# Altium project ArtixDuo.PrjPcb (part 3 of 8)

## Sheet FPGA_1.SchDoc
size A1; SheetNumber: 7; SheetTotal: 14
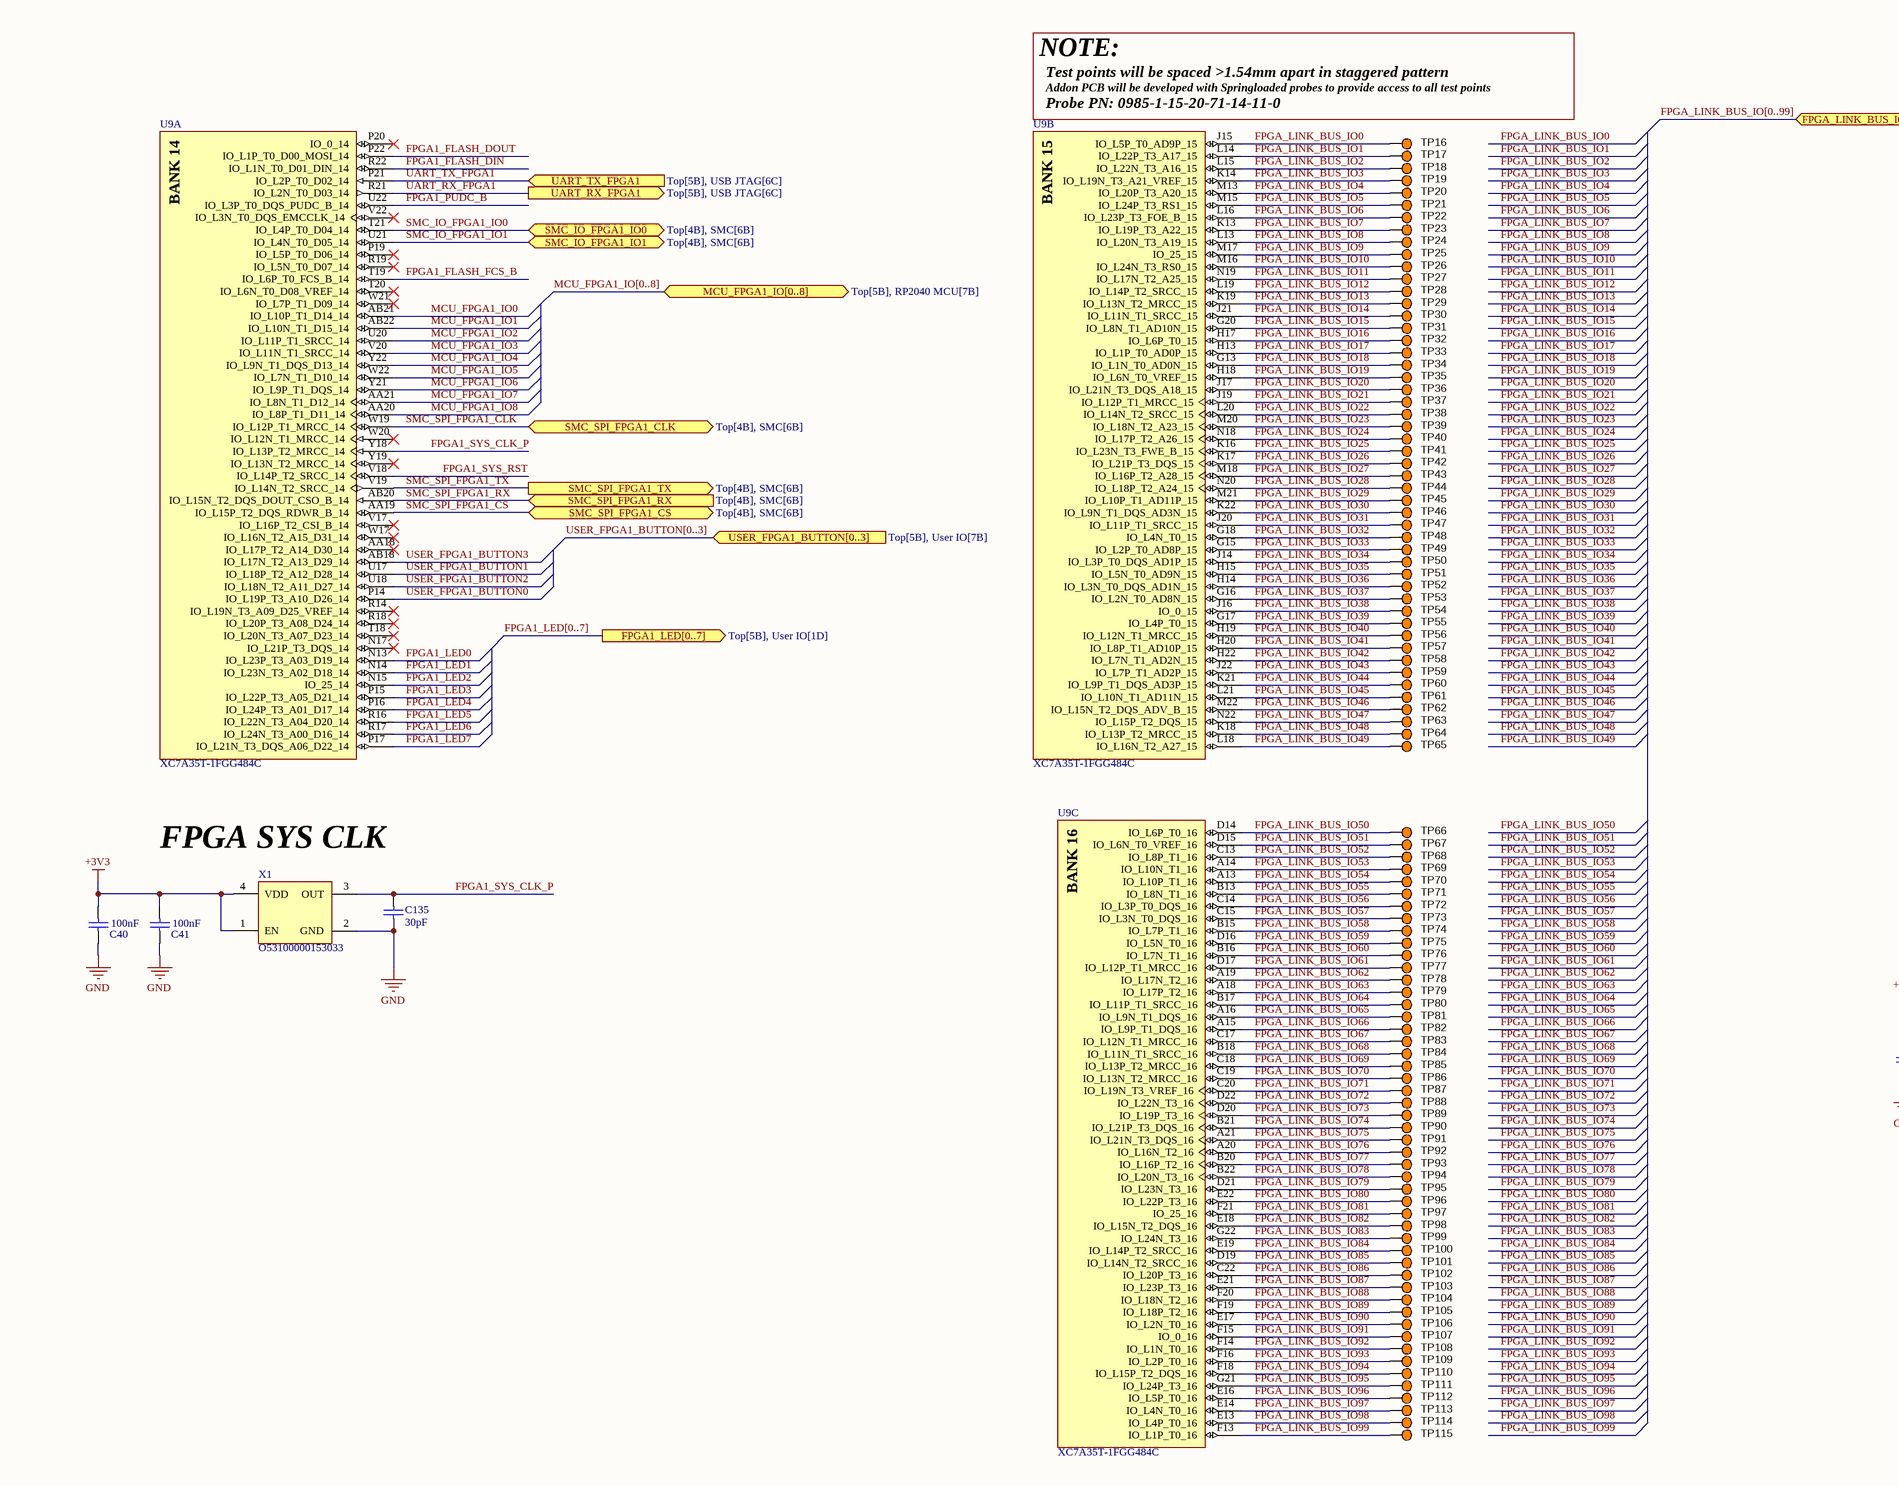
[diagram p8: FPGA_1.SchDoc, top left]
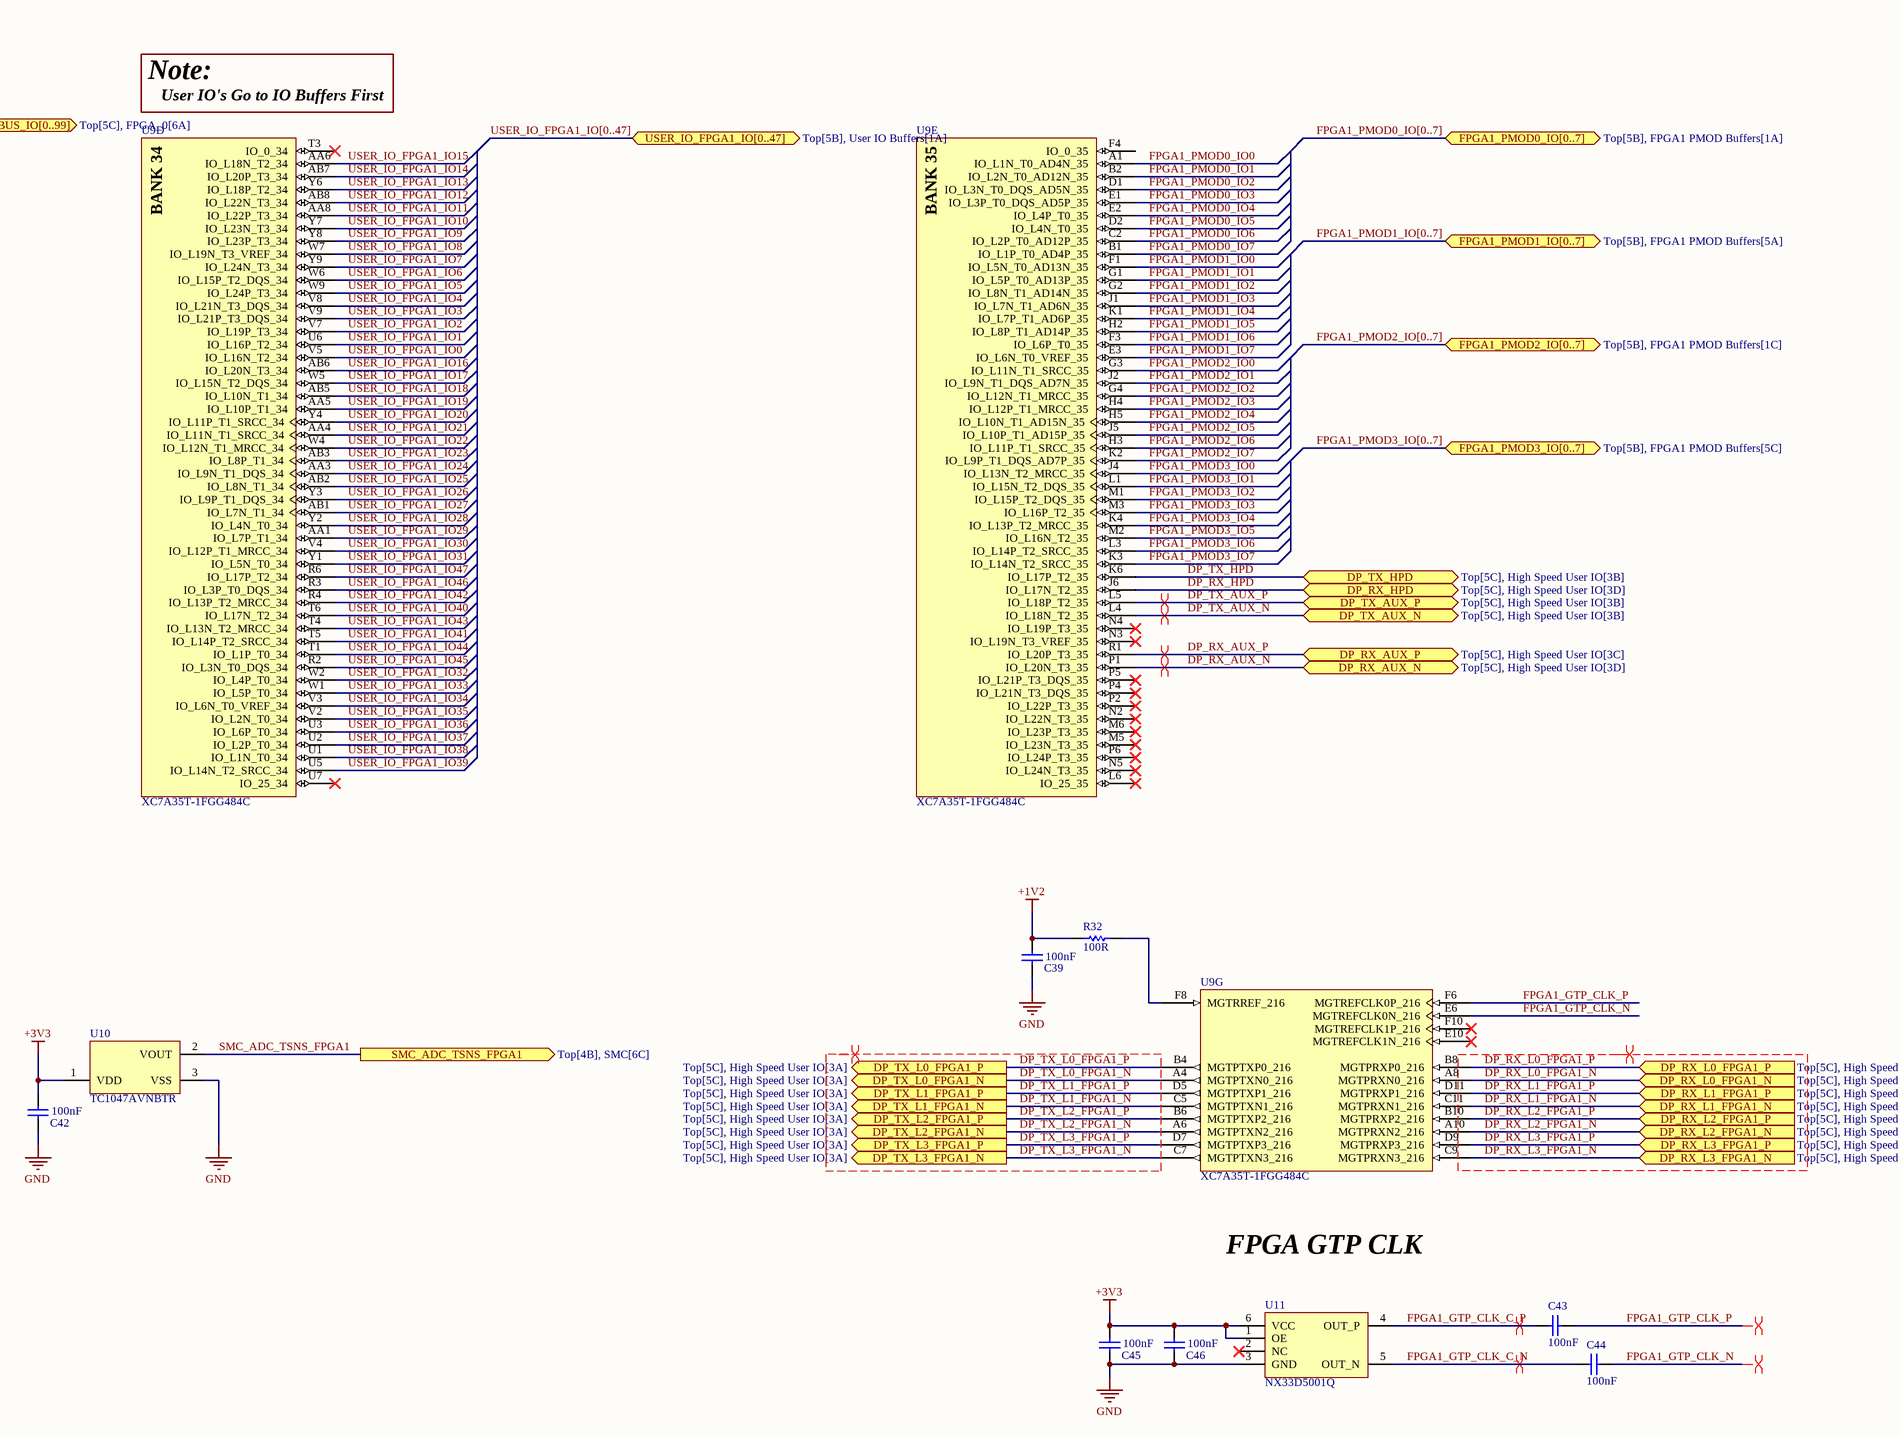
[diagram p9: FPGA_1.SchDoc, top right]
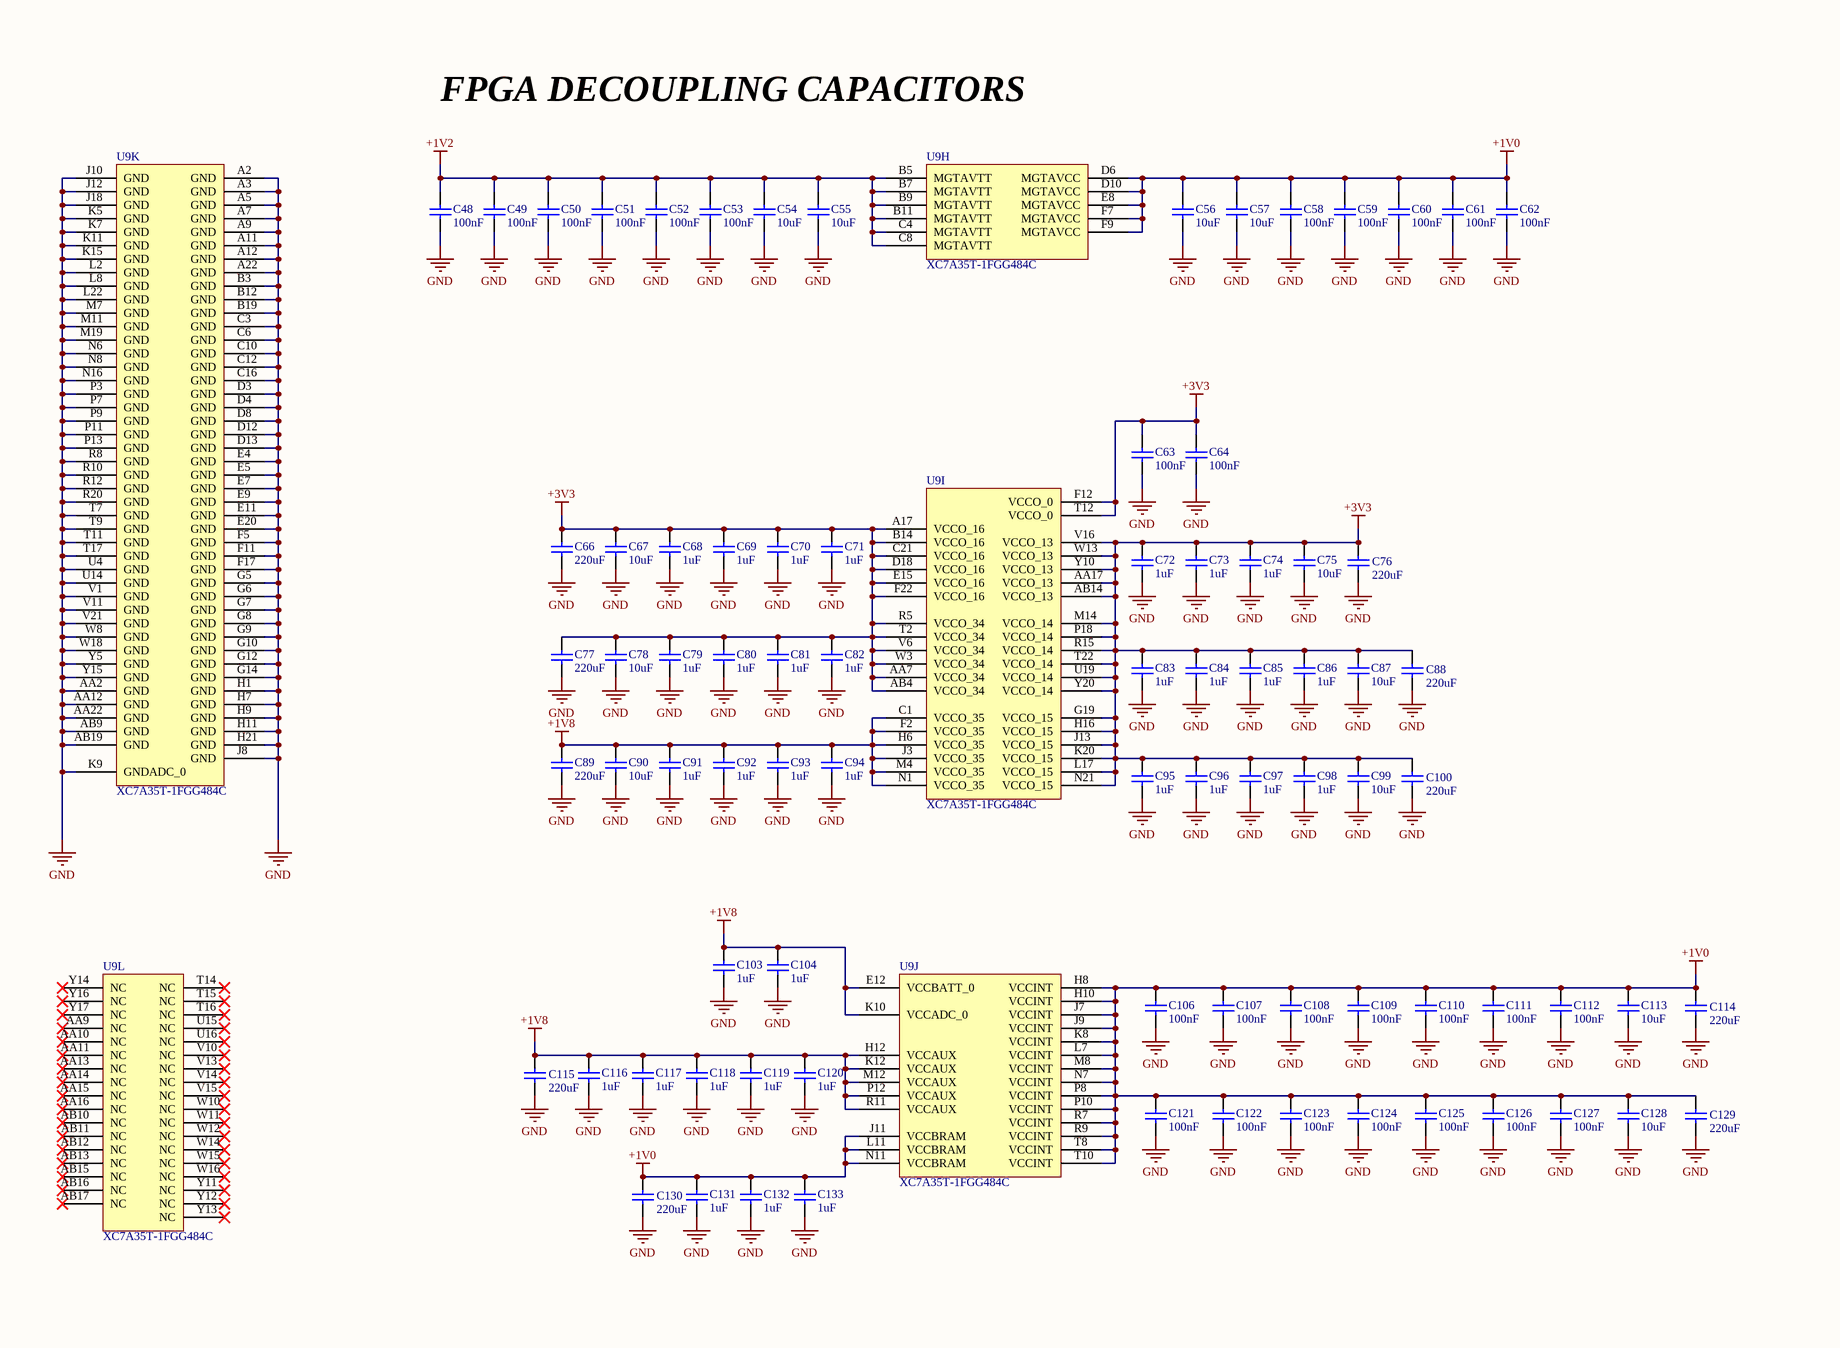
[diagram p10: FPGA_1.SchDoc, bottom left]
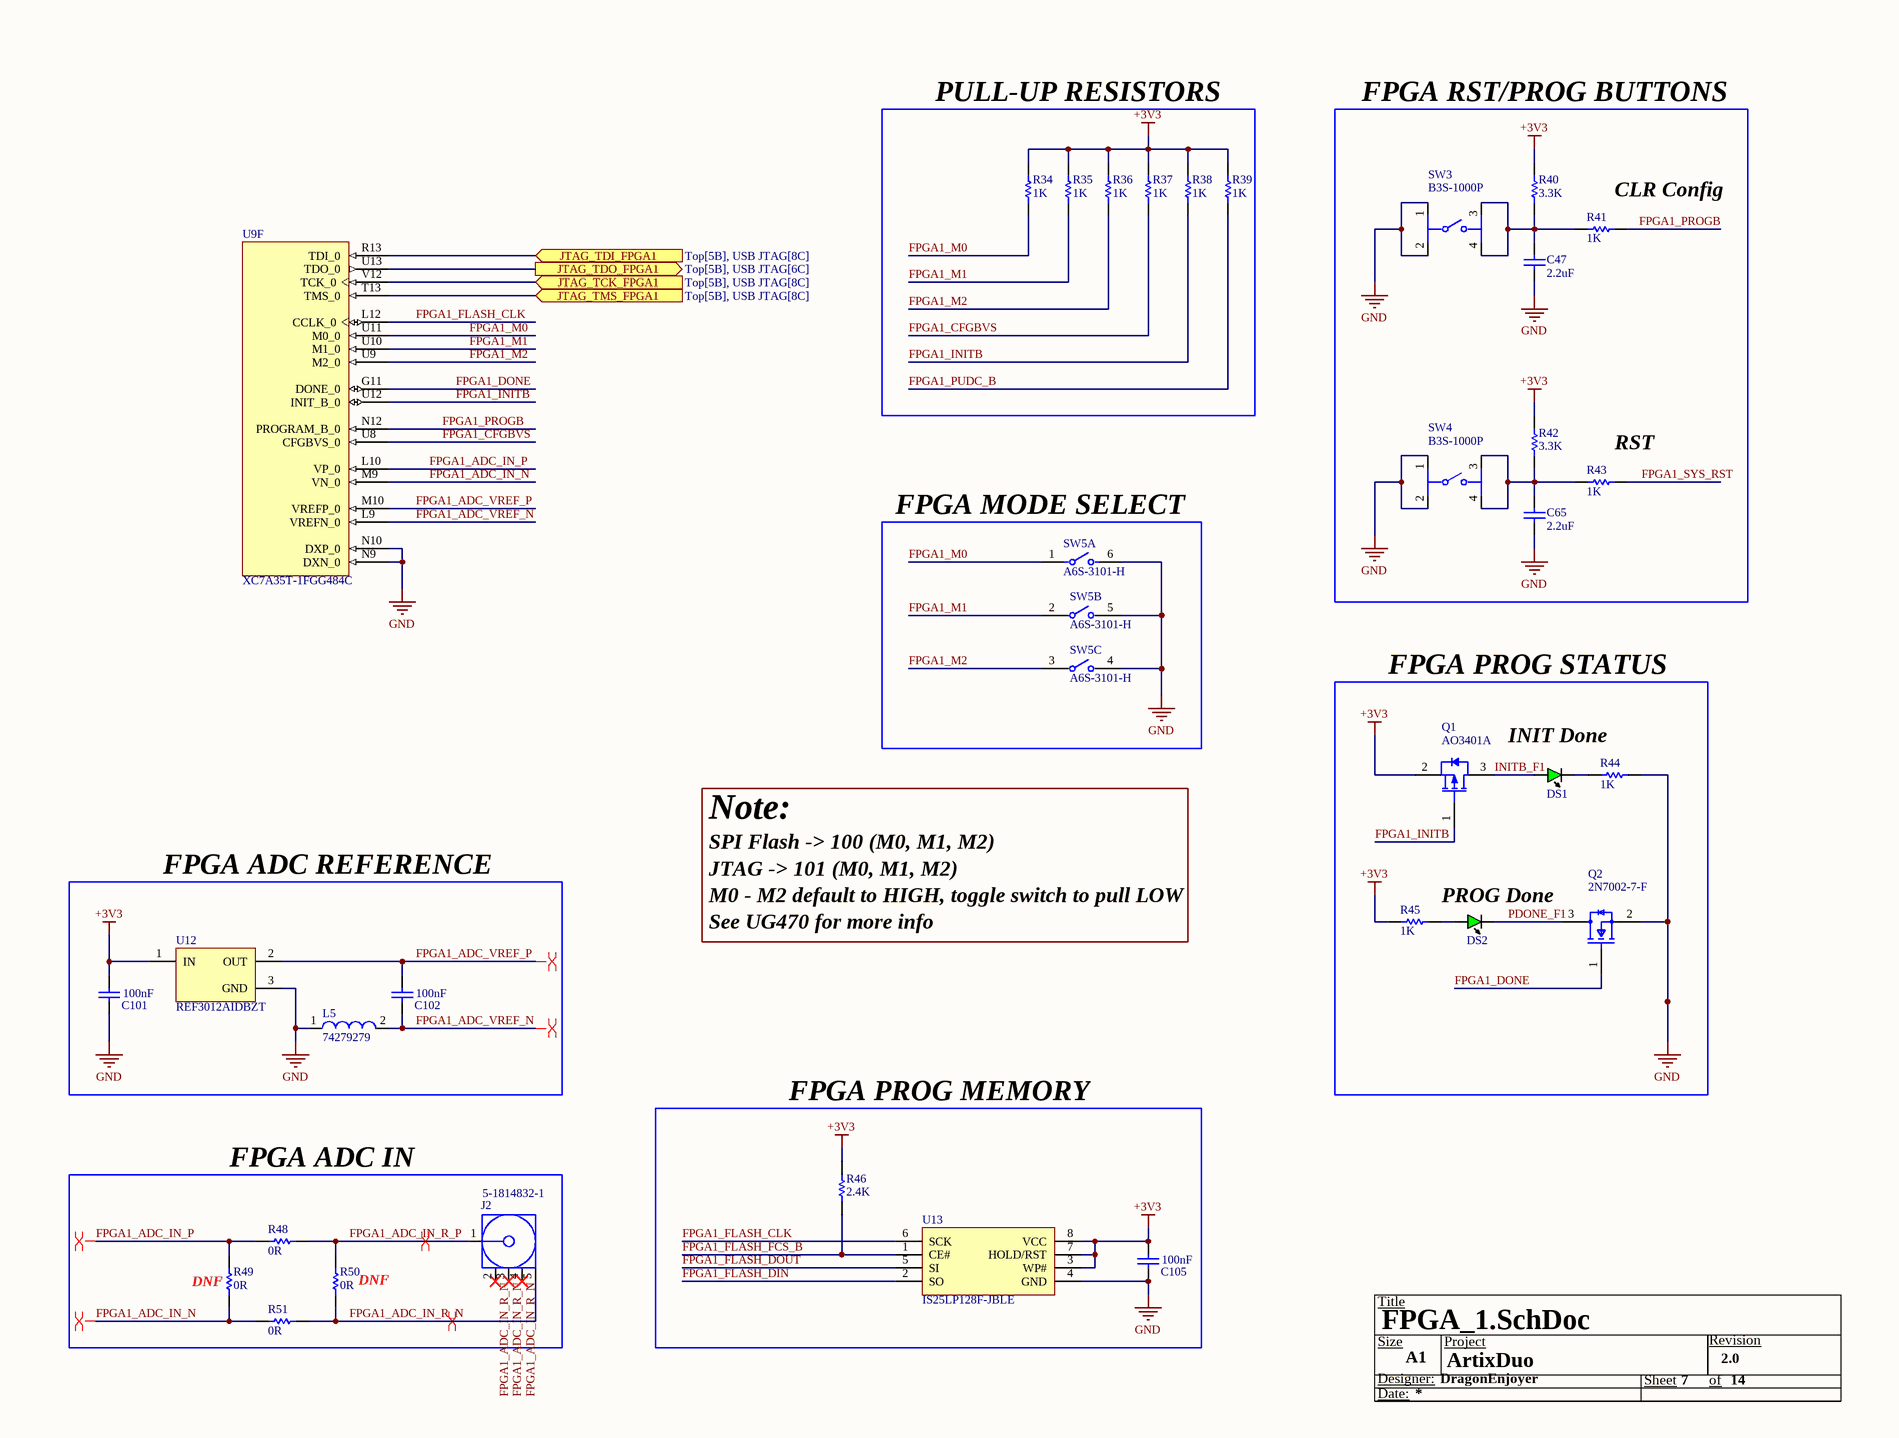
[diagram p11: FPGA_1.SchDoc, bottom right]

### Parts
(Parts that share a designator on the sheet are numbered #1, #2 ... from top to bottom, then left to right.)
*#4  Size: A1  (hidden comment: Title Block)  (graphical)
C39  100nF  [CAPC1005X05N]
C40  100nF  [CAPC1005X05N]
C41  100nF  [CAPC1005X05N]
C42  100nF  [CAPC1005X05N]
C43  100nF  [CAPC1005X05N]
C44  100nF  [CAPC1005X05N]
C45  100nF  [CAPC1005X05N]
C46  100nF  [CAPC1005X05N]
C47  2.2uF  [CAPC1005X55X25NL05T10]
C48  value 100nF  [CAPC1005X05N]  (hidden comment: GRM155R71E104KE14J)
C49  value 100nF  [CAPC1005X05N]  (hidden comment: GRM155R71E104KE14J)
C50  value 100nF  [CAPC1005X05N]  (hidden comment: GRM155R71E104KE14J)
C51  value 100nF  [CAPC1005X05N]  (hidden comment: GRM155R71E104KE14J)
C52  value 100nF  [CAPC1005X05N]  (hidden comment: GRM155R71E104KE14J)
C53  value 100nF  [CAPC1005X05N]  (hidden comment: GRM155R71E104KE14J)
C54  value 10uF  [CAPC1608X05N]  (hidden comment: GRM185R60J106ME15J)
C55  value 10uF  [CAPC1608X05N]  (hidden comment: GRM185R60J106ME15J)
C56  value 10uF  [CAPC1608X05N]  (hidden comment: GRM185R60J106ME15J)
C57  value 10uF  [CAPC1608X05N]  (hidden comment: GRM185R60J106ME15J)
C58  value 100nF  [CAPC1005X05N]  (hidden comment: GRM155R71E104KE14J)
C59  value 100nF  [CAPC1005X05N]  (hidden comment: GRM155R71E104KE14J)
C60  value 100nF  [CAPC1005X05N]  (hidden comment: GRM155R71E104KE14J)
C61  value 100nF  [CAPC1005X05N]  (hidden comment: GRM155R71E104KE14J)
C62  value 100nF  [CAPC1005X05N]  (hidden comment: GRM155R71E104KE14J)
C63  value 100nF  [CAPC1005X05N]  (hidden comment: GRM155R71E104KE14J)
C64  value 100nF  [CAPC1005X05N]  (hidden comment: GRM155R71E104KE14J)
C65  2.2uF  [CAPC1005X55X25NL05T10]
C66  220uF  [CAPC3225X25N]
C67  value 10uF  [CAPC1608X05N]  (hidden comment: GRM185R60J106ME15J)
C68  value 1uF  [CAPC1005X05N]  (hidden comment: GRM153R61A105ME95D)
C69  value 1uF  [CAPC1005X05N]  (hidden comment: GRM153R61A105ME95D)
C70  value 1uF  [CAPC1005X05N]  (hidden comment: GRM153R61A105ME95D)
C71  value 1uF  [CAPC1005X05N]  (hidden comment: GRM153R61A105ME95D)
C72  value 1uF  [CAPC1005X05N]  (hidden comment: GRM153R61A105ME95D)
C73  value 1uF  [CAPC1005X05N]  (hidden comment: GRM153R61A105ME95D)
C74  value 1uF  [CAPC1005X05N]  (hidden comment: GRM153R61A105ME95D)
C75  value 10uF  [CAPC1608X05N]  (hidden comment: GRM185R60J106ME15J)
C76  220uF  [CAPC3225X25N]
C77  220uF  [CAPC3225X25N]
C78  value 10uF  [CAPC1608X05N]  (hidden comment: GRM185R60J106ME15J)
C79  value 1uF  [CAPC1005X05N]  (hidden comment: GRM153R61A105ME95D)
C80  value 1uF  [CAPC1005X05N]  (hidden comment: GRM153R61A105ME95D)
C81  value 1uF  [CAPC1005X05N]  (hidden comment: GRM153R61A105ME95D)
C82  value 1uF  [CAPC1005X05N]  (hidden comment: GRM153R61A105ME95D)
C83  value 1uF  [CAPC1005X05N]  (hidden comment: GRM153R61A105ME95D)
C84  value 1uF  [CAPC1005X05N]  (hidden comment: GRM153R61A105ME95D)
C85  value 1uF  [CAPC1005X05N]  (hidden comment: GRM153R61A105ME95D)
C86  value 1uF  [CAPC1005X05N]  (hidden comment: GRM153R61A105ME95D)
C87  value 10uF  [CAPC1608X05N]  (hidden comment: GRM185R60J106ME15J)
C88  220uF  [CAPC3225X25N]
C89  220uF  [CAPC3225X25N]
C90  value 10uF  [CAPC1608X05N]  (hidden comment: GRM185R60J106ME15J)
C91  value 1uF  [CAPC1005X05N]  (hidden comment: GRM153R61A105ME95D)
C92  value 1uF  [CAPC1005X05N]  (hidden comment: GRM153R61A105ME95D)
C93  value 1uF  [CAPC1005X05N]  (hidden comment: GRM153R61A105ME95D)
C94  value 1uF  [CAPC1005X05N]  (hidden comment: GRM153R61A105ME95D)
C95  value 1uF  [CAPC1005X05N]  (hidden comment: GRM153R61A105ME95D)
C96  value 1uF  [CAPC1005X05N]  (hidden comment: GRM153R61A105ME95D)
C97  value 1uF  [CAPC1005X05N]  (hidden comment: GRM153R61A105ME95D)
C98  value 1uF  [CAPC1005X05N]  (hidden comment: GRM153R61A105ME95D)
C99  value 10uF  [CAPC1608X05N]  (hidden comment: GRM185R60J106ME15J)
C100  220uF  [CAPC3225X25N]
C101  100nF  [CAPC1005X05N]
C102  100nF  [CAPC1005X05N]
C103  value 1uF  [CAPC1005X05N]  (hidden comment: GRM153R61A105ME95D)
C104  value 1uF  [CAPC1005X05N]  (hidden comment: GRM153R61A105ME95D)
C105  100nF  [CAPC1005X05N]
C106  value 100nF  [CAPC1005X05N]  (hidden comment: GRM155R71E104KE14J)
C107  value 100nF  [CAPC1005X05N]  (hidden comment: GRM155R71E104KE14J)
C108  value 100nF  [CAPC1005X05N]  (hidden comment: GRM155R71E104KE14J)
C109  value 100nF  [CAPC1005X05N]  (hidden comment: GRM155R71E104KE14J)
C110  value 100nF  [CAPC1005X05N]  (hidden comment: GRM155R71E104KE14J)
C111  value 100nF  [CAPC1005X05N]  (hidden comment: GRM155R71E104KE14J)
C112  value 100nF  [CAPC1005X05N]  (hidden comment: GRM155R71E104KE14J)
C113  value 10uF  [CAPC1608X05N]  (hidden comment: GRM185R60J106ME15J)
C114  220uF  [CAPC3225X25N]
C115  220uF  [CAPC3225X25N]
C116  value 1uF  [CAPC1005X05N]  (hidden comment: GRM153R61A105ME95D)
C117  value 1uF  [CAPC1005X05N]  (hidden comment: GRM153R61A105ME95D)
C118  value 1uF  [CAPC1005X05N]  (hidden comment: GRM153R61A105ME95D)
C119  value 1uF  [CAPC1005X05N]  (hidden comment: GRM153R61A105ME95D)
C120  value 1uF  [CAPC1005X05N]  (hidden comment: GRM153R61A105ME95D)
C121  value 100nF  [CAPC1005X05N]  (hidden comment: GRM155R71E104KE14J)
C122  value 100nF  [CAPC1005X05N]  (hidden comment: GRM155R71E104KE14J)
C123  value 100nF  [CAPC1005X05N]  (hidden comment: GRM155R71E104KE14J)
C124  value 100nF  [CAPC1005X05N]  (hidden comment: GRM155R71E104KE14J)
C125  value 100nF  [CAPC1005X05N]  (hidden comment: GRM155R71E104KE14J)
C126  value 100nF  [CAPC1005X05N]  (hidden comment: GRM155R71E104KE14J)
C127  value 100nF  [CAPC1005X05N]  (hidden comment: GRM155R71E104KE14J)
C128  value 10uF  [CAPC1608X05N]  (hidden comment: GRM185R60J106ME15J)
C129  220uF  [CAPC3225X25N]
C130  220uF  [CAPC3225X25N]
C131  value 1uF  [CAPC1005X05N]  (hidden comment: GRM153R61A105ME95D)
C132  value 1uF  [CAPC1005X05N]  (hidden comment: GRM153R61A105ME95D)
C133  value 1uF  [CAPC1005X05N]  (hidden comment: GRM153R61A105ME95D)
C135  30pF  [CAPC1005X56X25NL10T15]
DS1  SMLLX0603GWTR  [LUMX-SML-LX0603_V]  (value not drawn)
DS2  SMLLX0603GWTR  [LUMX-SML-LX0603_V]  (value not drawn)
J2  5-1814832-1  [TECO-5-1814832-1_V]
L5  74279279  [SMD-0402]
Q1  AO3401A  [AO-SOT-23-3L_V]
Q2  2N7002-7-F  [FP-SOT23-MFG]
R32  100R  [RESC1005X40X25NL05T05]
R34  1K  [RESC1005X40X25NL05T10]
R35  1K  [RESC1005X40X25NL05T10]
R36  1K  [RESC1005X40X25NL05T10]
R37  1K  [RESC1005X40X25NL05T10]
R38  1K  [RESC1005X40X25NL05T10]
R39  1K  [RESC1005X40X25NL05T10]
R40  3.3K  [RESC1005X40X25NL05T10]
R41  1K  [RESC1005X40X25NL05T10]
R42  3.3K  [RESC1005X40X25NL05T10]
R43  1K  [RESC1005X40X25NL05T10]
R44  1K  [RESC1005X40X25NL05T10]
R45  1K  [RESC1005X40X25NL05T10]
R46  2.4K  [RESC1005X40X25NL05T05]
R48  0R  [RESC1005X40X25NL05T10]
R49  0R  [RESC1005X40X25NL05T10]
R50  0R  [RESC1005X40X25NL05T10]
R51  0R  [RESC1005X40X25NL05T10]
SW3  B3S-1000P  [FP-B3S-1000P-MFG]
SW4  B3S-1000P  [FP-B3S-1000P-MFG]
SW5  A6S-3101-H  [FP-A6S-3101-H-MFG]  (parts A,B,C of 3)
TP16  Test Point Round 0.5mm  [Test Point Round 0.5mm-Footprint-1]  (value not drawn)
TP17  Test Point Round 0.5mm  [Test Point Round 0.5mm-Footprint-1]  (value not drawn)
TP18  Test Point Round 0.5mm  [Test Point Round 0.5mm-Footprint-1]  (value not drawn)
TP19  Test Point Round 0.5mm  [Test Point Round 0.5mm-Footprint-1]  (value not drawn)
TP20  Test Point Round 0.5mm  [Test Point Round 0.5mm-Footprint-1]  (value not drawn)
TP21  Test Point Round 0.5mm  [Test Point Round 0.5mm-Footprint-1]  (value not drawn)
TP22  Test Point Round 0.5mm  [Test Point Round 0.5mm-Footprint-1]  (value not drawn)
TP23  Test Point Round 0.5mm  [Test Point Round 0.5mm-Footprint-1]  (value not drawn)
TP24  Test Point Round 0.5mm  [Test Point Round 0.5mm-Footprint-1]  (value not drawn)
TP25  Test Point Round 0.5mm  [Test Point Round 0.5mm-Footprint-1]  (value not drawn)
TP26  Test Point Round 0.5mm  [Test Point Round 0.5mm-Footprint-1]  (value not drawn)
TP27  Test Point Round 0.5mm  [Test Point Round 0.5mm-Footprint-1]  (value not drawn)
TP28  Test Point Round 0.5mm  [Test Point Round 0.5mm-Footprint-1]  (value not drawn)
TP29  Test Point Round 0.5mm  [Test Point Round 0.5mm-Footprint-1]  (value not drawn)
TP30  Test Point Round 0.5mm  [Test Point Round 0.5mm-Footprint-1]  (value not drawn)
TP31  Test Point Round 0.5mm  [Test Point Round 0.5mm-Footprint-1]  (value not drawn)
TP32  Test Point Round 0.5mm  [Test Point Round 0.5mm-Footprint-1]  (value not drawn)
TP33  Test Point Round 0.5mm  [Test Point Round 0.5mm-Footprint-1]  (value not drawn)
TP34  Test Point Round 0.5mm  [Test Point Round 0.5mm-Footprint-1]  (value not drawn)
TP35  Test Point Round 0.5mm  [Test Point Round 0.5mm-Footprint-1]  (value not drawn)
TP36  Test Point Round 0.5mm  [Test Point Round 0.5mm-Footprint-1]  (value not drawn)
TP37  Test Point Round 0.5mm  [Test Point Round 0.5mm-Footprint-1]  (value not drawn)
TP38  Test Point Round 0.5mm  [Test Point Round 0.5mm-Footprint-1]  (value not drawn)
TP39  Test Point Round 0.5mm  [Test Point Round 0.5mm-Footprint-1]  (value not drawn)
TP40  Test Point Round 0.5mm  [Test Point Round 0.5mm-Footprint-1]  (value not drawn)
TP41  Test Point Round 0.5mm  [Test Point Round 0.5mm-Footprint-1]  (value not drawn)
TP42  Test Point Round 0.5mm  [Test Point Round 0.5mm-Footprint-1]  (value not drawn)
TP43  Test Point Round 0.5mm  [Test Point Round 0.5mm-Footprint-1]  (value not drawn)
TP44  Test Point Round 0.5mm  [Test Point Round 0.5mm-Footprint-1]  (value not drawn)
TP45  Test Point Round 0.5mm  [Test Point Round 0.5mm-Footprint-1]  (value not drawn)
TP46  Test Point Round 0.5mm  [Test Point Round 0.5mm-Footprint-1]  (value not drawn)
TP47  Test Point Round 0.5mm  [Test Point Round 0.5mm-Footprint-1]  (value not drawn)
TP48  Test Point Round 0.5mm  [Test Point Round 0.5mm-Footprint-1]  (value not drawn)
TP49  Test Point Round 0.5mm  [Test Point Round 0.5mm-Footprint-1]  (value not drawn)
TP50  Test Point Round 0.5mm  [Test Point Round 0.5mm-Footprint-1]  (value not drawn)
TP51  Test Point Round 0.5mm  [Test Point Round 0.5mm-Footprint-1]  (value not drawn)
TP52  Test Point Round 0.5mm  [Test Point Round 0.5mm-Footprint-1]  (value not drawn)
TP53  Test Point Round 0.5mm  [Test Point Round 0.5mm-Footprint-1]  (value not drawn)
TP54  Test Point Round 0.5mm  [Test Point Round 0.5mm-Footprint-1]  (value not drawn)
TP55  Test Point Round 0.5mm  [Test Point Round 0.5mm-Footprint-1]  (value not drawn)
TP56  Test Point Round 0.5mm  [Test Point Round 0.5mm-Footprint-1]  (value not drawn)
TP57  Test Point Round 0.5mm  [Test Point Round 0.5mm-Footprint-1]  (value not drawn)
TP58  Test Point Round 0.5mm  [Test Point Round 0.5mm-Footprint-1]  (value not drawn)
TP59  Test Point Round 0.5mm  [Test Point Round 0.5mm-Footprint-1]  (value not drawn)
TP60  Test Point Round 0.5mm  [Test Point Round 0.5mm-Footprint-1]  (value not drawn)
TP61  Test Point Round 0.5mm  [Test Point Round 0.5mm-Footprint-1]  (value not drawn)
TP62  Test Point Round 0.5mm  [Test Point Round 0.5mm-Footprint-1]  (value not drawn)
TP63  Test Point Round 0.5mm  [Test Point Round 0.5mm-Footprint-1]  (value not drawn)
TP64  Test Point Round 0.5mm  [Test Point Round 0.5mm-Footprint-1]  (value not drawn)
TP65  Test Point Round 0.5mm  [Test Point Round 0.5mm-Footprint-1]  (value not drawn)
TP66  Test Point Round 0.5mm  [Test Point Round 0.5mm-Footprint-1]  (value not drawn)
TP67  Test Point Round 0.5mm  [Test Point Round 0.5mm-Footprint-1]  (value not drawn)
TP68  Test Point Round 0.5mm  [Test Point Round 0.5mm-Footprint-1]  (value not drawn)
TP69  Test Point Round 0.5mm  [Test Point Round 0.5mm-Footprint-1]  (value not drawn)
TP70  Test Point Round 0.5mm  [Test Point Round 0.5mm-Footprint-1]  (value not drawn)
TP71  Test Point Round 0.5mm  [Test Point Round 0.5mm-Footprint-1]  (value not drawn)
TP72  Test Point Round 0.5mm  [Test Point Round 0.5mm-Footprint-1]  (value not drawn)
TP73  Test Point Round 0.5mm  [Test Point Round 0.5mm-Footprint-1]  (value not drawn)
TP74  Test Point Round 0.5mm  [Test Point Round 0.5mm-Footprint-1]  (value not drawn)
TP75  Test Point Round 0.5mm  [Test Point Round 0.5mm-Footprint-1]  (value not drawn)
TP76  Test Point Round 0.5mm  [Test Point Round 0.5mm-Footprint-1]  (value not drawn)
TP77  Test Point Round 0.5mm  [Test Point Round 0.5mm-Footprint-1]  (value not drawn)
TP78  Test Point Round 0.5mm  [Test Point Round 0.5mm-Footprint-1]  (value not drawn)
TP79  Test Point Round 0.5mm  [Test Point Round 0.5mm-Footprint-1]  (value not drawn)
TP80  Test Point Round 0.5mm  [Test Point Round 0.5mm-Footprint-1]  (value not drawn)
TP81  Test Point Round 0.5mm  [Test Point Round 0.5mm-Footprint-1]  (value not drawn)
TP82  Test Point Round 0.5mm  [Test Point Round 0.5mm-Footprint-1]  (value not drawn)
TP83  Test Point Round 0.5mm  [Test Point Round 0.5mm-Footprint-1]  (value not drawn)
TP84  Test Point Round 0.5mm  [Test Point Round 0.5mm-Footprint-1]  (value not drawn)
TP85  Test Point Round 0.5mm  [Test Point Round 0.5mm-Footprint-1]  (value not drawn)
TP86  Test Point Round 0.5mm  [Test Point Round 0.5mm-Footprint-1]  (value not drawn)
TP87  Test Point Round 0.5mm  [Test Point Round 0.5mm-Footprint-1]  (value not drawn)
TP88  Test Point Round 0.5mm  [Test Point Round 0.5mm-Footprint-1]  (value not drawn)
TP89  Test Point Round 0.5mm  [Test Point Round 0.5mm-Footprint-1]  (value not drawn)
TP90  Test Point Round 0.5mm  [Test Point Round 0.5mm-Footprint-1]  (value not drawn)
TP91  Test Point Round 0.5mm  [Test Point Round 0.5mm-Footprint-1]  (value not drawn)
TP92  Test Point Round 0.5mm  [Test Point Round 0.5mm-Footprint-1]  (value not drawn)
TP93  Test Point Round 0.5mm  [Test Point Round 0.5mm-Footprint-1]  (value not drawn)
TP94  Test Point Round 0.5mm  [Test Point Round 0.5mm-Footprint-1]  (value not drawn)
TP95  Test Point Round 0.5mm  [Test Point Round 0.5mm-Footprint-1]  (value not drawn)
TP96  Test Point Round 0.5mm  [Test Point Round 0.5mm-Footprint-1]  (value not drawn)
TP97  Test Point Round 0.5mm  [Test Point Round 0.5mm-Footprint-1]  (value not drawn)
TP98  Test Point Round 0.5mm  [Test Point Round 0.5mm-Footprint-1]  (value not drawn)
TP99  Test Point Round 0.5mm  [Test Point Round 0.5mm-Footprint-1]  (value not drawn)
TP100  Test Point Round 0.5mm  [Test Point Round 0.5mm-Footprint-1]  (value not drawn)
TP101  Test Point Round 0.5mm  [Test Point Round 0.5mm-Footprint-1]  (value not drawn)
TP102  Test Point Round 0.5mm  [Test Point Round 0.5mm-Footprint-1]  (value not drawn)
TP103  Test Point Round 0.5mm  [Test Point Round 0.5mm-Footprint-1]  (value not drawn)
TP104  Test Point Round 0.5mm  [Test Point Round 0.5mm-Footprint-1]  (value not drawn)
TP105  Test Point Round 0.5mm  [Test Point Round 0.5mm-Footprint-1]  (value not drawn)
TP106  Test Point Round 0.5mm  [Test Point Round 0.5mm-Footprint-1]  (value not drawn)
TP107  Test Point Round 0.5mm  [Test Point Round 0.5mm-Footprint-1]  (value not drawn)
TP108  Test Point Round 0.5mm  [Test Point Round 0.5mm-Footprint-1]  (value not drawn)
TP109  Test Point Round 0.5mm  [Test Point Round 0.5mm-Footprint-1]  (value not drawn)
TP110  Test Point Round 0.5mm  [Test Point Round 0.5mm-Footprint-1]  (value not drawn)
TP111  Test Point Round 0.5mm  [Test Point Round 0.5mm-Footprint-1]  (value not drawn)
TP112  Test Point Round 0.5mm  [Test Point Round 0.5mm-Footprint-1]  (value not drawn)
TP113  Test Point Round 0.5mm  [Test Point Round 0.5mm-Footprint-1]  (value not drawn)
TP114  Test Point Round 0.5mm  [Test Point Round 0.5mm-Footprint-1]  (value not drawn)
TP115  Test Point Round 0.5mm  [Test Point Round 0.5mm-Footprint-1]  (value not drawn)
U9  XC7A35T-1FGG484C  [FGG484]  (parts A,B,C,D,E,F,G,H,I,J,K,L of 12)
U10  TC1047AVNBTR  [SOT-23-NB3_L]
U11  NX33D5001Q  [SOTFL125P185X90-6N]
U12  REF3012AIDBZT  [DBZ0003A_L]
U13  IS25LP128F-JBLE  [SOIC127P790X216-8N]
X1  O53100000153033  [DFN254P500X120-4N]

### Blocks framed on the sheet
PULL-UP RESISTORS: R34-R39
FPGA RST/PROG BUTTONS: C47 C65 R40-R43 SW3 SW4
FPGA MODE SELECT: SW5
FPGA PROG STATUS: DS1 DS2 Q1 Q2 R44 R45
FPGA ADC REFERENCE: C101 C102 L5 U12
FPGA PROG MEMORY: C105 R46 U13

### Ports
DP_RX_AUX_N (bidir, see Top[5C], High Speed User IO[3D]), DP_RX_AUX_P (bidir, see Top[5C], High Speed User IO[3C]), DP_RX_HPD (bidir, see Top[5C], High Speed User IO[3D]), DP_RX_L0_FPGA1_N (in, see Top[5C], High Speed User IO[3C]), DP_RX_L0_FPGA1_P (in, see Top[5C], High Speed User IO[3C]), DP_RX_L1_FPGA1_N (in, see Top[5C], High Speed User IO[3C]), DP_RX_L1_FPGA1_P (in, see Top[5C], High Speed User IO[3C]), DP_RX_L2_FPGA1_N (in, see Top[5C], High Speed User IO[3C]), DP_RX_L2_FPGA1_P (in, see Top[5C], High Speed User IO[3C]), DP_RX_L3_FPGA1_N (in, see Top[5C], High Speed User IO[3C]), DP_RX_L3_FPGA1_P (in, see Top[5C], High Speed User IO[3C]), DP_TX_AUX_N (bidir, see Top[5C], High Speed User IO[3B]), DP_TX_AUX_P (bidir, see Top[5C], High Speed User IO[3B]), DP_TX_HPD (bidir, see Top[5C], High Speed User IO[3B]), DP_TX_L0_FPGA1_N (out, see Top[5C], High Speed User IO[3A]), DP_TX_L0_FPGA1_P (out, see Top[5C], High Speed User IO[3A]), DP_TX_L1_FPGA1_N (out, see Top[5C], High Speed User IO[3A]), DP_TX_L1_FPGA1_P (out, see Top[5C], High Speed User IO[3A]), DP_TX_L2_FPGA1_N (out, see Top[5C], High Speed User IO[3A]), DP_TX_L2_FPGA1_P (out, see Top[5C], High Speed User IO[3A]), DP_TX_L3_FPGA1_N (out, see Top[5C], High Speed User IO[3A]), DP_TX_L3_FPGA1_P (out, see Top[5C], High Speed User IO[3A]), FPGA1_LED[0..7] (out, see Top[5B], User IO[1D]), FPGA1_PMOD0_IO[0..7] (bidir, see Top[5B], FPGA1 PMOD Buffers[1A]), FPGA1_PMOD1_IO[0..7] (bidir, see Top[5B], FPGA1 PMOD Buffers[5A]), FPGA1_PMOD2_IO[0..7] (bidir, see Top[5B], FPGA1 PMOD Buffers[1C]), FPGA1_PMOD3_IO[0..7] (bidir, see Top[5B], FPGA1 PMOD Buffers[5C]), FPGA_LINK_BUS_IO[0..99] (bidir, see Top[5C], FPGA_0[6A]), JTAG_TCK_FPGA1 (in, see Top[5B], USB JTAG[8C]), JTAG_TDI_FPGA1 (in, see Top[5B], USB JTAG[8C]), JTAG_TDO_FPGA1 (out, see Top[5B], USB JTAG[6C]), JTAG_TMS_FPGA1 (in, see Top[5B], USB JTAG[8C]), MCU_FPGA1_IO[0..8] (bidir, see Top[5B], RP2040 MCU[7B]), SMC_ADC_TSNS_FPGA1 (out, see Top[4B], SMC[6C]), SMC_IO_FPGA1_IO0 (bidir, see Top[4B], SMC[6B]), SMC_IO_FPGA1_IO1 (bidir, see Top[4B], SMC[6B]), SMC_SPI_FPGA1_CLK (bidir, see Top[4B], SMC[6B]), SMC_SPI_FPGA1_CS (bidir, see Top[4B], SMC[6B]), SMC_SPI_FPGA1_RX (in, see Top[4B], SMC[6B]), SMC_SPI_FPGA1_TX (out, see Top[4B], SMC[6B]), UART_RX_FPGA1 (out, see Top[5B], USB JTAG[6C]), UART_TX_FPGA1 (in, see Top[5B], USB JTAG[6C]), USER_FPGA1_BUTTON[0..3] (in, see Top[5B], User IO[7B]), USER_IO_FPGA1_IO[0..47] (bidir, see Top[5B], User IO Buffers[1A])

### Nets
+1V0: C56.2 C57.2 C58.2 C59.2 C60.2 C61.2 C62.2 C106.2 C107.2 C108.2 C109.2 C110.2 C111.2 C112.2 C113.2 C114.2 C121.2 C122.2 C123.2 C124.2 C125.2 C126.2 C127.2 C128.2 C129.2 C130.2 C131.2 C132.2 C133.2 U9.D6(MGTAVCC) U9.D10(MGTAVCC) U9.E8(MGTAVCC) U9.F7(MGTAVCC) U9.F9(MGTAVCC) U9.H8(VCCINT) U9.H10(VCCINT) U9.J7(VCCINT) U9.J9(VCCINT) U9.J11(VCCBRAM) U9.K8(VCCINT) U9.L7(VCCINT) U9.L11(VCCBRAM) U9.M8(VCCINT) U9.N7(VCCINT) U9.N11(VCCBRAM) U9.P8(VCCINT) U9.P10(VCCINT) U9.R7(VCCINT) U9.R9(VCCINT) U9.T8(VCCINT) U9.T10(VCCINT)
+1V2: C39.2 C48.2 C49.2 C50.2 C51.2 C52.2 C53.2 C54.2 C55.2 R32.1 U9.B5(MGTAVTT) U9.B7(MGTAVTT) U9.B9(MGTAVTT) U9.B11(MGTAVTT) U9.C4(MGTAVTT) U9.C8(MGTAVTT)
+1V8: C89.2 C90.2 C91.2 C92.2 C93.2 C94.2 C103.2 C104.2 C115.2 C116.2 C117.2 C118.2 C119.2 C120.2 U9.C1(VCCO_35) U9.E12(VCCBATT_0) U9.F2(VCCO_35) U9.H6(VCCO_35) U9.H12(VCCAUX) U9.J3(VCCO_35) U9.K10(VCCADC_0) U9.K12(VCCAUX) U9.M4(VCCO_35) U9.M12(VCCAUX) U9.N1(VCCO_35) U9.P12(VCCAUX) U9.R11(VCCAUX)
+3V3: C40.2 C41.2 C42.2 C45.2 C46.2 C63.2 C64.2 C66.2 C67.2 C68.2 C69.2 C70.2 C71.2 C72.2 C73.2 C74.2 C75.2 C76.2 C77.2 C78.2 C79.2 C80.2 C81.2 C82.2 C83.2 C84.2 C85.2 C86.2 C87.2 C88.2 C95.2 C96.2 C97.2 C98.2 C99.2 C100.2 C101.2 C105.2 Q1.2(SOURCE) R34.2 R35.2 R36.2 R37.2 R38.2 R39.2 R40.2 R42.2 R45.2 R46.2 U9.A17(VCCO_16) U9.AA7(VCCO_34) U9.AA17(VCCO_13) U9.AB4(VCCO_34) U9.AB14(VCCO_13) U9.B14(VCCO_16) U9.C21(VCCO_16) U9.D18(VCCO_16) U9.E15(VCCO_16) U9.F12(VCCO_0) U9.F22(VCCO_16) U9.G19(VCCO_15) U9.H16(VCCO_15) U9.J13(VCCO_15) U9.K20(VCCO_15) U9.L17(VCCO_15) U9.M14(VCCO_14) U9.N21(VCCO_15) U9.P18(VCCO_14) U9.R5(VCCO_34) U9.R15(VCCO_14) U9.T2(VCCO_34) U9.T12(VCCO_0) U9.T22(VCCO_14) U9.U19(VCCO_14) U9.V6(VCCO_34) U9.V16(VCCO_13) U9.W3(VCCO_34) U9.W13(VCCO_13) U9.Y10(VCCO_13) U9.Y20(VCCO_14) U10.1(VDD) U11.1(OE) U11.6(VCC) U12.1(IN) U13.3(WP#) U13.7(HOLD/RST) U13.8(VCC) X1.1(EN) X1.4(VDD)
GND: C39.1 C40.1 C41.1 C42.1 C45.1 C46.1 C47.1 C48.1 C49.1 C50.1 C51.1 C52.1 C53.1 C54.1 C55.1 C56.1 C57.1 C58.1 C59.1 C60.1 C61.1 C62.1 C63.1 C64.1 C65.1 C66.1 C67.1 C68.1 C69.1 C70.1 C71.1 C72.1 C73.1 C74.1 C75.1 C76.1 C77.1 C78.1 C79.1 C80.1 C81.1 C82.1 C83.1 C84.1 C85.1 C86.1 C87.1 C88.1 C89.1 C90.1 C91.1 C92.1 C93.1 C94.1 C95.1 C96.1 C97.1 C98.1 C99.1 C100.1 C101.1 C103.1 C104.1 C105.1 C106.1 C107.1 C108.1 C109.1 C110.1 C111.1 C112.1 C113.1 C114.1 C115.1 C116.1 C117.1 C118.1 C119.1 C120.1 C121.1 C122.1 C123.1 C124.1 C125.1 C126.1 C127.1 C128.1 C129.1 C130.1 C131.1 C132.1 C133.1 C135.1 L5.1 Q2.2(S) R44.1 SW3.1 SW3.2 SW4.1 SW4.2 SW5.4 SW5.5 SW5.6 U9.A2(GND) U9.A3(GND) U9.A5(GND) U9.A7(GND) U9.A9(GND) U9.A11(GND) U9.A12(GND) U9.A22(GND) U9.AA2(GND) U9.AA12(GND) U9.AA22(GND) U9.AB9(GND) U9.AB19(GND) U9.B3(GND) U9.B12(GND) U9.B19(GND) U9.C3(GND) U9.C6(GND) U9.C10(GND) U9.C12(GND) U9.C16(GND) U9.D3(GND) U9.D4(GND) U9.D8(GND) U9.D12(GND) U9.D13(GND) U9.E4(GND) U9.E5(GND) U9.E7(GND) U9.E9(GND) U9.E11(GND) U9.E20(GND) U9.F5(GND) U9.F11(GND) U9.F17(GND) U9.G5(GND) U9.G6(GND) U9.G7(GND) U9.G8(GND) U9.G9(GND) U9.G10(GND) U9.G12(GND) U9.G14(GND) U9.H1(GND) U9.H7(GND) U9.H9(GND) U9.H11(GND) U9.H21(GND) U9.J8(GND) U9.J10(GND) U9.J12(GND) U9.J18(GND) U9.K5(GND) U9.K7(GND) U9.K9(GNDADC_0) U9.K11(GND) U9.K15(GND) U9.L2(GND) U9.L8(GND) U9.L22(GND) U9.M7(GND) U9.M11(GND) U9.M19(GND) U9.N6(GND) U9.N8(GND) U9.N9(DXN_0) U9.N10(DXP_0) U9.N16(GND) U9.P3(GND) U9.P7(GND) U9.P9(GND) U9.P11(GND) U9.P13(GND) U9.R8(GND) U9.R10(GND) U9.R12(GND) U9.R20(GND) U9.T7(GND) U9.T9(GND) U9.T11(GND) U9.T17(GND) U9.U4(GND) U9.U14(GND) U9.V1(GND) U9.V11(GND) U9.V21(GND) U9.W8(GND) U9.W18(GND) U9.Y5(GND) U9.Y15(GND) U10.3(VSS) U11.3(GND) U12.3(GND) U13.4(GND) X1.2(GND)
DP_RX_AUX_N: U9.P1(IO_L20N_T3_35) ; port DP_RX_AUX_N
DP_RX_AUX_P: U9.R1(IO_L20P_T3_35) ; port DP_RX_AUX_P
DP_RX_HPD: U9.J6(IO_L17N_T2_35) ; port DP_RX_HPD
DP_RX_L0_FPGA1_N: U9.A8(MGTPRXN0_216) ; port DP_RX_L0_FPGA1_N
DP_RX_L0_FPGA1_P: U9.B8(MGTPRXP0_216) ; port DP_RX_L0_FPGA1_P
DP_RX_L1_FPGA1_N: U9.C11(MGTPRXN1_216) ; port DP_RX_L1_FPGA1_N
DP_RX_L1_FPGA1_P: U9.D11(MGTPRXP1_216) ; port DP_RX_L1_FPGA1_P
DP_RX_L2_FPGA1_N: U9.A10(MGTPRXN2_216) ; port DP_RX_L2_FPGA1_N
DP_RX_L2_FPGA1_P: U9.B10(MGTPRXP2_216) ; port DP_RX_L2_FPGA1_P
DP_RX_L3_FPGA1_N: U9.C9(MGTPRXN3_216) ; port DP_RX_L3_FPGA1_N
DP_RX_L3_FPGA1_P: U9.D9(MGTPRXP3_216) ; port DP_RX_L3_FPGA1_P
DP_TX_AUX_N: U9.L4(IO_L18N_T2_35) ; port DP_TX_AUX_N
DP_TX_AUX_P: U9.L5(IO_L18P_T2_35) ; port DP_TX_AUX_P
DP_TX_HPD: U9.K6(IO_L17P_T2_35) ; port DP_TX_HPD
DP_TX_L0_FPGA1_N: U9.A4(MGTPTXN0_216) ; port DP_TX_L0_FPGA1_N
DP_TX_L0_FPGA1_P: U9.B4(MGTPTXP0_216) ; port DP_TX_L0_FPGA1_P
DP_TX_L1_FPGA1_N: U9.C5(MGTPTXN1_216) ; port DP_TX_L1_FPGA1_N
DP_TX_L1_FPGA1_P: U9.D5(MGTPTXP1_216) ; port DP_TX_L1_FPGA1_P
DP_TX_L2_FPGA1_N: U9.A6(MGTPTXN2_216) ; port DP_TX_L2_FPGA1_N
DP_TX_L2_FPGA1_P: U9.B6(MGTPTXP2_216) ; port DP_TX_L2_FPGA1_P
DP_TX_L3_FPGA1_N: U9.C7(MGTPTXN3_216) ; port DP_TX_L3_FPGA1_N
DP_TX_L3_FPGA1_P: U9.D7(MGTPTXP3_216) ; port DP_TX_L3_FPGA1_P
FPGA1_ADC_IN_N: R49.1 R51.1 U9.M9(VN_0)
FPGA1_ADC_IN_P: R48.1 R49.2 U9.L10(VP_0)
FPGA1_ADC_IN_R_N: J2.2 J2.3 J2.4 J2.5 R50.1 R51.2
FPGA1_ADC_IN_R_P: J2.1 R48.2 R50.2
FPGA1_ADC_VREF_N: C102.1 L5.2 U9.L9(VREFN_0)
FPGA1_ADC_VREF_P: C102.2 U9.M10(VREFP_0) U12.2(OUT)
FPGA1_CFGBVS: R37.1 U9.U8(CFGBVS_0)
FPGA1_DONE: Q2.1(G) U9.G11(DONE_0)
FPGA1_FLASH_CLK: U9.L12(CCLK_0) U13.6(SCK)
FPGA1_FLASH_DIN: U9.R22(IO_L1N_T0_D01_DIN_14) U13.2(SO)
FPGA1_FLASH_DOUT: U9.P22(IO_L1P_T0_D00_MOSI_14) U13.5(SI)
FPGA1_FLASH_FCS_B: R46.1 U9.T19(IO_L6P_T0_FCS_B_14) U13.1(CE#)
FPGA1_GTP_CLK_C_N: C44.2 U11.5(OUT_N)
FPGA1_GTP_CLK_C_P: C43.2 U11.4(OUT_P)
FPGA1_GTP_CLK_N: C44.1 U9.E6(MGTREFCLK0N_216)
FPGA1_GTP_CLK_P: C43.1 U9.F6(MGTREFCLK0P_216)
FPGA1_INITB: Q1.1(GATE) R38.1 U9.U12(INIT_B_0)
FPGA1_LED0: U9.N13(IO_L23P_T3_A03_D19_14)
FPGA1_LED1: U9.N14(IO_L23N_T3_A02_D18_14)
FPGA1_LED2: U9.N15(IO_25_14)
FPGA1_LED3: U9.P15(IO_L22P_T3_A05_D21_14)
FPGA1_LED4: U9.P16(IO_L24P_T3_A01_D17_14)
FPGA1_LED5: U9.R16(IO_L22N_T3_A04_D20_14)
FPGA1_LED6: U9.R17(IO_L24N_T3_A00_D16_14)
FPGA1_LED7: U9.P17(IO_L21N_T3_DQS_A06_D22_14)
FPGA1_M0: R34.1 SW5.1 U9.U11(M0_0)
FPGA1_M1: R35.1 SW5.2 U9.U10(M1_0)
FPGA1_M2: R36.1 SW5.3 U9.U9(M2_0)
FPGA1_PMOD0_IO0: U9.A1(IO_L1N_T0_AD4N_35)
FPGA1_PMOD0_IO1: U9.B2(IO_L2N_T0_AD12N_35)
FPGA1_PMOD0_IO2: U9.D1(IO_L3N_T0_DQS_AD5N_35)
FPGA1_PMOD0_IO3: U9.E1(IO_L3P_T0_DQS_AD5P_35)
FPGA1_PMOD0_IO4: U9.E2(IO_L4P_T0_35)
FPGA1_PMOD0_IO5: U9.D2(IO_L4N_T0_35)
FPGA1_PMOD0_IO6: U9.C2(IO_L2P_T0_AD12P_35)
FPGA1_PMOD0_IO7: U9.B1(IO_L1P_T0_AD4P_35)
FPGA1_PMOD1_IO0: U9.F1(IO_L5N_T0_AD13N_35)
FPGA1_PMOD1_IO1: U9.G1(IO_L5P_T0_AD13P_35)
FPGA1_PMOD1_IO2: U9.G2(IO_L8N_T1_AD14N_35)
FPGA1_PMOD1_IO3: U9.J1(IO_L7N_T1_AD6N_35)
FPGA1_PMOD1_IO4: U9.K1(IO_L7P_T1_AD6P_35)
FPGA1_PMOD1_IO5: U9.H2(IO_L8P_T1_AD14P_35)
FPGA1_PMOD1_IO6: U9.F3(IO_L6P_T0_35)
FPGA1_PMOD1_IO7: U9.E3(IO_L6N_T0_VREF_35)
FPGA1_PMOD2_IO0: U9.G3(IO_L11N_T1_SRCC_35)
FPGA1_PMOD2_IO1: U9.J2(IO_L9N_T1_DQS_AD7N_35)
FPGA1_PMOD2_IO2: U9.G4(IO_L12N_T1_MRCC_35)
FPGA1_PMOD2_IO3: U9.H4(IO_L12P_T1_MRCC_35)
FPGA1_PMOD2_IO4: U9.H5(IO_L10N_T1_AD15N_35)
FPGA1_PMOD2_IO5: U9.J5(IO_L10P_T1_AD15P_35)
FPGA1_PMOD2_IO6: U9.H3(IO_L11P_T1_SRCC_35)
FPGA1_PMOD2_IO7: U9.K2(IO_L9P_T1_DQS_AD7P_35)
FPGA1_PMOD3_IO0: U9.J4(IO_L13N_T2_MRCC_35)
FPGA1_PMOD3_IO1: U9.L1(IO_L15N_T2_DQS_35)
FPGA1_PMOD3_IO2: U9.M1(IO_L15P_T2_DQS_35)
FPGA1_PMOD3_IO3: U9.M3(IO_L16P_T2_35)
FPGA1_PMOD3_IO4: U9.K4(IO_L13P_T2_MRCC_35)
FPGA1_PMOD3_IO5: U9.M2(IO_L16N_T2_35)
FPGA1_PMOD3_IO6: U9.L3(IO_L14P_T2_SRCC_35)
FPGA1_PMOD3_IO7: U9.K3(IO_L14N_T2_SRCC_35)
FPGA1_PROGB: R41.1 U9.N12(PROGRAM_B_0)
FPGA1_PUDC_B: R39.1 U9.U22(IO_L3P_T0_DQS_PUDC_B_14)
FPGA1_SYS_CLK_P: C135.2 U9.Y18(IO_L13P_T2_MRCC_14) X1.3(OUT)
FPGA1_SYS_RST: R43.1 U9.V18(IO_L14P_T2_SRCC_14)
FPGA_LINK_BUS_IO0: TP16.1 U9.J15(IO_L5P_T0_AD9P_15)
FPGA_LINK_BUS_IO1: TP17.1 U9.L14(IO_L22P_T3_A17_15)
FPGA_LINK_BUS_IO2: TP18.1 U9.L15(IO_L22N_T3_A16_15)
FPGA_LINK_BUS_IO3: TP19.1 U9.K14(IO_L19N_T3_A21_VREF_15)
FPGA_LINK_BUS_IO4: TP20.1 U9.M13(IO_L20P_T3_A20_15)
FPGA_LINK_BUS_IO5: TP21.1 U9.M15(IO_L24P_T3_RS1_15)
FPGA_LINK_BUS_IO6: TP22.1 U9.L16(IO_L23P_T3_FOE_B_15)
FPGA_LINK_BUS_IO7: TP23.1 U9.K13(IO_L19P_T3_A22_15)
FPGA_LINK_BUS_IO8: TP24.1 U9.L13(IO_L20N_T3_A19_15)
FPGA_LINK_BUS_IO9: TP25.1 U9.M17(IO_25_15)
FPGA_LINK_BUS_IO10: TP26.1 U9.M16(IO_L24N_T3_RS0_15)
FPGA_LINK_BUS_IO11: TP27.1 U9.N19(IO_L17N_T2_A25_15)
FPGA_LINK_BUS_IO12: TP28.1 U9.L19(IO_L14P_T2_SRCC_15)
FPGA_LINK_BUS_IO13: TP29.1 U9.K19(IO_L13N_T2_MRCC_15)
FPGA_LINK_BUS_IO14: TP30.1 U9.J21(IO_L11N_T1_SRCC_15)
FPGA_LINK_BUS_IO15: TP31.1 U9.G20(IO_L8N_T1_AD10N_15)
FPGA_LINK_BUS_IO16: TP32.1 U9.H17(IO_L6P_T0_15)
FPGA_LINK_BUS_IO17: TP33.1 U9.H13(IO_L1P_T0_AD0P_15)
FPGA_LINK_BUS_IO18: TP34.1 U9.G13(IO_L1N_T0_AD0N_15)
FPGA_LINK_BUS_IO19: TP35.1 U9.H18(IO_L6N_T0_VREF_15)
FPGA_LINK_BUS_IO20: TP36.1 U9.J17(IO_L21N_T3_DQS_A18_15)
FPGA_LINK_BUS_IO21: TP37.1 U9.J19(IO_L12P_T1_MRCC_15)
FPGA_LINK_BUS_IO22: TP38.1 U9.L20(IO_L14N_T2_SRCC_15)
FPGA_LINK_BUS_IO23: TP39.1 U9.M20(IO_L18N_T2_A23_15)
FPGA_LINK_BUS_IO24: TP40.1 U9.N18(IO_L17P_T2_A26_15)
FPGA_LINK_BUS_IO25: TP41.1 U9.K16(IO_L23N_T3_FWE_B_15)
FPGA_LINK_BUS_IO26: TP42.1 U9.K17(IO_L21P_T3_DQS_15)
FPGA_LINK_BUS_IO27: TP43.1 U9.M18(IO_L16P_T2_A28_15)
FPGA_LINK_BUS_IO28: TP44.1 U9.N20(IO_L18P_T2_A24_15)
FPGA_LINK_BUS_IO29: TP45.1 U9.M21(IO_L10P_T1_AD11P_15)
FPGA_LINK_BUS_IO30: TP46.1 U9.K22(IO_L9N_T1_DQS_AD3N_15)
FPGA_LINK_BUS_IO31: TP47.1 U9.J20(IO_L11P_T1_SRCC_15)
FPGA_LINK_BUS_IO32: TP48.1 U9.G18(IO_L4N_T0_15)
FPGA_LINK_BUS_IO33: TP49.1 U9.G15(IO_L2P_T0_AD8P_15)
FPGA_LINK_BUS_IO34: TP50.1 U9.J14(IO_L3P_T0_DQS_AD1P_15)
FPGA_LINK_BUS_IO35: TP51.1 U9.H15(IO_L5N_T0_AD9N_15)
FPGA_LINK_BUS_IO36: TP52.1 U9.H14(IO_L3N_T0_DQS_AD1N_15)
FPGA_LINK_BUS_IO37: TP53.1 U9.G16(IO_L2N_T0_AD8N_15)
FPGA_LINK_BUS_IO38: TP54.1 U9.J16(IO_0_15)
FPGA_LINK_BUS_IO39: TP55.1 U9.G17(IO_L4P_T0_15)
FPGA_LINK_BUS_IO40: TP56.1 U9.H19(IO_L12N_T1_MRCC_15)
FPGA_LINK_BUS_IO41: TP57.1 U9.H20(IO_L8P_T1_AD10P_15)
FPGA_LINK_BUS_IO42: TP58.1 U9.H22(IO_L7N_T1_AD2N_15)
FPGA_LINK_BUS_IO43: TP59.1 U9.J22(IO_L7P_T1_AD2P_15)
FPGA_LINK_BUS_IO44: TP60.1 U9.K21(IO_L9P_T1_DQS_AD3P_15)
FPGA_LINK_BUS_IO45: TP61.1 U9.L21(IO_L10N_T1_AD11N_15)
FPGA_LINK_BUS_IO46: TP62.1 U9.M22(IO_L15N_T2_DQS_ADV_B_15)
FPGA_LINK_BUS_IO47: TP63.1 U9.N22(IO_L15P_T2_DQS_15)
FPGA_LINK_BUS_IO48: TP64.1 U9.K18(IO_L13P_T2_MRCC_15)
FPGA_LINK_BUS_IO49: TP65.1 U9.L18(IO_L16N_T2_A27_15)
FPGA_LINK_BUS_IO50: TP66.1 U9.D14(IO_L6P_T0_16)
FPGA_LINK_BUS_IO51: TP67.1 U9.D15(IO_L6N_T0_VREF_16)
FPGA_LINK_BUS_IO52: TP68.1 U9.C13(IO_L8P_T1_16)
FPGA_LINK_BUS_IO53: TP69.1 U9.A14(IO_L10N_T1_16)
FPGA_LINK_BUS_IO54: TP70.1 U9.A13(IO_L10P_T1_16)
FPGA_LINK_BUS_IO55: TP71.1 U9.B13(IO_L8N_T1_16)
FPGA_LINK_BUS_IO56: TP72.1 U9.C14(IO_L3P_T0_DQS_16)
FPGA_LINK_BUS_IO57: TP73.1 U9.C15(IO_L3N_T0_DQS_16)
FPGA_LINK_BUS_IO58: TP74.1 U9.B15(IO_L7P_T1_16)
FPGA_LINK_BUS_IO59: TP75.1 U9.D16(IO_L5N_T0_16)
FPGA_LINK_BUS_IO60: TP76.1 U9.B16(IO_L7N_T1_16)
FPGA_LINK_BUS_IO61: TP77.1 U9.D17(IO_L12P_T1_MRCC_16)
FPGA_LINK_BUS_IO62: TP78.1 U9.A19(IO_L17N_T2_16)
FPGA_LINK_BUS_IO63: TP79.1 U9.A18(IO_L17P_T2_16)
FPGA_LINK_BUS_IO64: TP80.1 U9.B17(IO_L11P_T1_SRCC_16)
FPGA_LINK_BUS_IO65: TP81.1 U9.A16(IO_L9N_T1_DQS_16)
FPGA_LINK_BUS_IO66: TP82.1 U9.A15(IO_L9P_T1_DQS_16)
FPGA_LINK_BUS_IO67: TP83.1 U9.C17(IO_L12N_T1_MRCC_16)
FPGA_LINK_BUS_IO68: TP84.1 U9.B18(IO_L11N_T1_SRCC_16)
FPGA_LINK_BUS_IO69: TP85.1 U9.C18(IO_L13P_T2_MRCC_16)
FPGA_LINK_BUS_IO70: TP86.1 U9.C19(IO_L13N_T2_MRCC_16)
FPGA_LINK_BUS_IO71: TP87.1 U9.C20(IO_L19N_T3_VREF_16)
FPGA_LINK_BUS_IO72: TP88.1 U9.D22(IO_L22N_T3_16)
FPGA_LINK_BUS_IO73: TP89.1 U9.D20(IO_L19P_T3_16)
FPGA_LINK_BUS_IO74: TP90.1 U9.B21(IO_L21P_T3_DQS_16)
FPGA_LINK_BUS_IO75: TP91.1 U9.A21(IO_L21N_T3_DQS_16)
FPGA_LINK_BUS_IO76: TP92.1 U9.A20(IO_L16N_T2_16)
FPGA_LINK_BUS_IO77: TP93.1 U9.B20(IO_L16P_T2_16)
FPGA_LINK_BUS_IO78: TP94.1 U9.B22(IO_L20N_T3_16)
FPGA_LINK_BUS_IO79: TP95.1 U9.D21(IO_L23N_T3_16)
FPGA_LINK_BUS_IO80: TP96.1 U9.E22(IO_L22P_T3_16)
FPGA_LINK_BUS_IO81: TP97.1 U9.F21(IO_25_16)
FPGA_LINK_BUS_IO82: TP98.1 U9.E18(IO_L15N_T2_DQS_16)
FPGA_LINK_BUS_IO83: TP99.1 U9.G22(IO_L24N_T3_16)
FPGA_LINK_BUS_IO84: TP100.1 U9.E19(IO_L14P_T2_SRCC_16)
FPGA_LINK_BUS_IO85: TP101.1 U9.D19(IO_L14N_T2_SRCC_16)
FPGA_LINK_BUS_IO86: TP102.1 U9.C22(IO_L20P_T3_16)
FPGA_LINK_BUS_IO87: TP103.1 U9.E21(IO_L23P_T3_16)
FPGA_LINK_BUS_IO88: TP104.1 U9.F20(IO_L18N_T2_16)
FPGA_LINK_BUS_IO89: TP105.1 U9.F19(IO_L18P_T2_16)
FPGA_LINK_BUS_IO90: TP106.1 U9.E17(IO_L2N_T0_16)
FPGA_LINK_BUS_IO91: TP107.1 U9.F15(IO_0_16)
FPGA_LINK_BUS_IO92: TP108.1 U9.F14(IO_L1N_T0_16)
FPGA_LINK_BUS_IO93: TP109.1 U9.F16(IO_L2P_T0_16)
FPGA_LINK_BUS_IO94: TP110.1 U9.F18(IO_L15P_T2_DQS_16)
FPGA_LINK_BUS_IO95: TP111.1 U9.G21(IO_L24P_T3_16)
FPGA_LINK_BUS_IO96: TP112.1 U9.E16(IO_L5P_T0_16)
FPGA_LINK_BUS_IO97: TP113.1 U9.E14(IO_L4N_T0_16)
FPGA_LINK_BUS_IO98: TP114.1 U9.E13(IO_L4P_T0_16)
FPGA_LINK_BUS_IO99: TP115.1 U9.F13(IO_L1P_T0_16)
INITB_F1: DS1.1(A) Q1.3(DRAIN)
JTAG_TCK_FPGA1: U9.V12(TCK_0) ; port JTAG_TCK_FPGA1
JTAG_TDI_FPGA1: U9.R13(TDI_0) ; port JTAG_TDI_FPGA1
JTAG_TDO_FPGA1: U9.U13(TDO_0) ; port JTAG_TDO_FPGA1
JTAG_TMS_FPGA1: U9.T13(TMS_0) ; port JTAG_TMS_FPGA1
MCU_FPGA1_IO0: U9.AB21(IO_L10P_T1_D14_14)
MCU_FPGA1_IO1: U9.AB22(IO_L10N_T1_D15_14)
MCU_FPGA1_IO2: U9.U20(IO_L11P_T1_SRCC_14)
MCU_FPGA1_IO3: U9.V20(IO_L11N_T1_SRCC_14)
MCU_FPGA1_IO4: U9.Y22(IO_L9N_T1_DQS_D13_14)
MCU_FPGA1_IO5: U9.W22(IO_L7N_T1_D10_14)
MCU_FPGA1_IO6: U9.Y21(IO_L9P_T1_DQS_14)
MCU_FPGA1_IO7: U9.AA21(IO_L8N_T1_D12_14)
MCU_FPGA1_IO8: U9.AA20(IO_L8P_T1_D11_14)
PDONE_F1: DS2.2(K) Q2.3(D)
SMC_ADC_TSNS_FPGA1: U10.2(VOUT) ; port SMC_ADC_TSNS_FPGA1
SMC_IO_FPGA1_IO0: U9.T21(IO_L4P_T0_D04_14) ; port SMC_IO_FPGA1_IO0
SMC_IO_FPGA1_IO1: U9.U21(IO_L4N_T0_D05_14) ; port SMC_IO_FPGA1_IO1
SMC_SPI_FPGA1_CLK: U9.W19(IO_L12P_T1_MRCC_14) ; port SMC_SPI_FPGA1_CLK
SMC_SPI_FPGA1_CS: U9.AA19(IO_L15P_T2_DQS_RDWR_B_14) ; port SMC_SPI_FPGA1_CS
SMC_SPI_FPGA1_RX: U9.AB20(IO_L15N_T2_DQS_DOUT_CSO_B_14) ; port SMC_SPI_FPGA1_RX
SMC_SPI_FPGA1_TX: U9.V19(IO_L14N_T2_SRCC_14) ; port SMC_SPI_FPGA1_TX
UART_RX_FPGA1: U9.R21(IO_L2N_T0_D03_14) ; port UART_RX_FPGA1
UART_TX_FPGA1: U9.P21(IO_L2P_T0_D02_14) ; port UART_TX_FPGA1
USER_FPGA1_BUTTON0: U9.P14(IO_L19P_T3_A10_D26_14)
USER_FPGA1_BUTTON1: U9.U17(IO_L18P_T2_A12_D28_14)
USER_FPGA1_BUTTON2: U9.U18(IO_L18N_T2_A11_D27_14)
USER_FPGA1_BUTTON3: U9.AB18(IO_L17N_T2_A13_D29_14)
USER_IO_FPGA1_IO0: U9.V5(IO_L16N_T2_34)
USER_IO_FPGA1_IO1: U9.U6(IO_L16P_T2_34)
USER_IO_FPGA1_IO2: U9.V7(IO_L19P_T3_34)
USER_IO_FPGA1_IO3: U9.V9(IO_L21P_T3_DQS_34)
USER_IO_FPGA1_IO4: U9.V8(IO_L21N_T3_DQS_34)
USER_IO_FPGA1_IO5: U9.W9(IO_L24P_T3_34)
USER_IO_FPGA1_IO6: U9.W6(IO_L15P_T2_DQS_34)
USER_IO_FPGA1_IO7: U9.Y9(IO_L24N_T3_34)
USER_IO_FPGA1_IO8: U9.W7(IO_L19N_T3_VREF_34)
USER_IO_FPGA1_IO9: U9.Y8(IO_L23P_T3_34)
USER_IO_FPGA1_IO10: U9.Y7(IO_L23N_T3_34)
USER_IO_FPGA1_IO11: U9.AA8(IO_L22P_T3_34)
USER_IO_FPGA1_IO12: U9.AB8(IO_L22N_T3_34)
USER_IO_FPGA1_IO13: U9.Y6(IO_L18P_T2_34)
USER_IO_FPGA1_IO14: U9.AB7(IO_L20P_T3_34)
USER_IO_FPGA1_IO15: U9.AA6(IO_L18N_T2_34)
USER_IO_FPGA1_IO16: U9.AB6(IO_L20N_T3_34)
USER_IO_FPGA1_IO17: U9.W5(IO_L15N_T2_DQS_34)
USER_IO_FPGA1_IO18: U9.AB5(IO_L10N_T1_34)
USER_IO_FPGA1_IO19: U9.AA5(IO_L10P_T1_34)
USER_IO_FPGA1_IO20: U9.Y4(IO_L11P_T1_SRCC_34)
USER_IO_FPGA1_IO21: U9.AA4(IO_L11N_T1_SRCC_34)
USER_IO_FPGA1_IO22: U9.W4(IO_L12N_T1_MRCC_34)
USER_IO_FPGA1_IO23: U9.AB3(IO_L8P_T1_34)
USER_IO_FPGA1_IO24: U9.AA3(IO_L9N_T1_DQS_34)
USER_IO_FPGA1_IO25: U9.AB2(IO_L8N_T1_34)
USER_IO_FPGA1_IO26: U9.Y3(IO_L9P_T1_DQS_34)
USER_IO_FPGA1_IO27: U9.AB1(IO_L7N_T1_34)
USER_IO_FPGA1_IO28: U9.Y2(IO_L4N_T0_34)
USER_IO_FPGA1_IO29: U9.AA1(IO_L7P_T1_34)
USER_IO_FPGA1_IO30: U9.V4(IO_L12P_T1_MRCC_34)
USER_IO_FPGA1_IO31: U9.Y1(IO_L5N_T0_34)
USER_IO_FPGA1_IO32: U9.W2(IO_L4P_T0_34)
USER_IO_FPGA1_IO33: U9.W1(IO_L5P_T0_34)
USER_IO_FPGA1_IO34: U9.V3(IO_L6N_T0_VREF_34)
USER_IO_FPGA1_IO35: U9.V2(IO_L2N_T0_34)
USER_IO_FPGA1_IO36: U9.U3(IO_L6P_T0_34)
USER_IO_FPGA1_IO37: U9.U2(IO_L2P_T0_34)
USER_IO_FPGA1_IO38: U9.U1(IO_L1N_T0_34)
USER_IO_FPGA1_IO39: U9.U5(IO_L14N_T2_SRCC_34)
USER_IO_FPGA1_IO40: U9.T6(IO_L17N_T2_34)
USER_IO_FPGA1_IO41: U9.T5(IO_L14P_T2_SRCC_34)
USER_IO_FPGA1_IO42: U9.R4(IO_L13P_T2_MRCC_34)
USER_IO_FPGA1_IO43: U9.T4(IO_L13N_T2_MRCC_34)
USER_IO_FPGA1_IO44: U9.T1(IO_L1P_T0_34)
USER_IO_FPGA1_IO45: U9.R2(IO_L3N_T0_DQS_34)
USER_IO_FPGA1_IO46: U9.R3(IO_L3P_T0_DQS_34)
USER_IO_FPGA1_IO47: U9.R6(IO_L17P_T2_34)
NetC47_2: C47.2 R40.1 R41.2 SW3.3 SW3.4
NetC65_2: C65.2 R42.1 R43.2 SW4.3 SW4.4
NetDS1_2: DS1.2(K) R44.2
NetDS2_1: DS2.1(A) R45.1
NetR32_2: R32.2 U9.F8(MGTRREF_216)

Not connected (* = marked no-connect by the designer): U9 AA9(NC)* AA10(NC)* AA11(NC)* AA13(NC)* AA14(NC)* AA15(NC)* AA16(NC)* AA18(IO_L17P_T2_A14_D30_14)* AB10(NC)* AB11(NC)* AB12(NC)* AB13(NC)* AB15(NC)* AB16(NC)* AB17(NC)* E10(MGTREFCLK1N_216)* F4(IO_0_35) F10(MGTREFCLK1P_216)* L6(IO_25_35)* M5(IO_L23N_T3_35)* M6(IO_L23P_T3_35)* N2(IO_L22N_T3_35)* N3(IO_L19N_T3_VREF_35)* N4(IO_L19P_T3_35)* N5(IO_L24N_T3_35)* N17(IO_L21P_T3_DQS_14)* P2(IO_L22P_T3_35)* P4(IO_L21N_T3_DQS_35)* P5(IO_L21P_T3_DQS_35)* P6(IO_L24P_T3_35)* P19(IO_L5P_T0_D06_14)* P20(IO_0_14)* R14(IO_L19N_T3_A09_D25_VREF_14)* R18(IO_L20P_T3_A08_D24_14)* R19(IO_L5N_T0_D07_14)* T3(IO_0_34)* T14(NC)* T15(NC)* T16(NC)* T18(IO_L20N_T3_A07_D23_14)* T20(IO_L6N_T0_D08_VREF_14)* U7(IO_25_34)* U15(NC)* U16(NC)* V10(NC)* V13(NC)* V14(NC)* V15(NC)* V17(IO_L16P_T2_CSI_B_14)* V22(IO_L3N_T0_DQS_EMCCLK_14)* W10(NC)* W11(NC)* W12(NC)* W14(NC)* W15(NC)* W16(NC)* W17(IO_L16N_T2_A15_D31_14)* W20(IO_L12N_T1_MRCC_14)* W21(IO_L7P_T1_D09_14)* Y11(NC)* Y12(NC)* Y13(NC)* Y14(NC)* Y16(NC)* Y17(NC)* Y19(IO_L13N_T2_MRCC_14)*; U11 2(NC)*

### Buses and harness runs
bus FPGA1_LED[0..7] = port FPGA1_LED[0..7]
bus FPGA1_PMOD0_IO[0..7] = port FPGA1_PMOD0_IO[0..7]
bus FPGA1_PMOD1_IO[0..7] = port FPGA1_PMOD1_IO[0..7]
bus FPGA1_PMOD2_IO[0..7] = port FPGA1_PMOD2_IO[0..7]
bus FPGA1_PMOD3_IO[0..7] = port FPGA1_PMOD3_IO[0..7]
bus FPGA_LINK_BUS_IO[0..99] = port FPGA_LINK_BUS_IO[0..99]
bus MCU_FPGA1_IO[0..8] = port MCU_FPGA1_IO[0..8]
bus USER_FPGA1_BUTTON[0..3] = port USER_FPGA1_BUTTON[0..3]
bus USER_IO_FPGA1_IO[0..47] = port USER_IO_FPGA1_IO[0..47]

### Layout directives
differential pair: DP_RX_AUX_N, DP_RX_AUX_P, DP_RX_L0_FPGA1_N, DP_RX_L0_FPGA1_P, DP_RX_L1_FPGA1_N, DP_RX_L1_FPGA1_P, DP_RX_L2_FPGA1_N, DP_RX_L2_FPGA1_P, DP_RX_L3_FPGA1_N, DP_RX_L3_FPGA1_P, DP_TX_AUX_N, DP_TX_AUX_P, DP_TX_L0_FPGA1_N, DP_TX_L0_FPGA1_P, DP_TX_L1_FPGA1_N, DP_TX_L1_FPGA1_P, DP_TX_L2_FPGA1_N, DP_TX_L2_FPGA1_P, DP_TX_L3_FPGA1_N, DP_TX_L3_FPGA1_P, FPGA1_ADC_IN_N, FPGA1_ADC_IN_P, FPGA1_ADC_IN_R_N, FPGA1_ADC_IN_R_P, FPGA1_ADC_VREF_N, FPGA1_ADC_VREF_P, FPGA1_GTP_CLK_C_N, FPGA1_GTP_CLK_C_P, FPGA1_GTP_CLK_N, FPGA1_GTP_CLK_P

### Notes on the sheet
- NOTE:
- Test points will be spaced >1.54mm apart in staggered pattern
- Addon PCB will be developed with Springloaded probes to provide access to all test points
- Note:
- (near U9) Probe PN: 0985-1-15-20-71-14-11-0
- (near U9) User IO's Go to IO Buffers First
- (near X1) FPGA SYS CLK
- FPGA GTP CLK
- FPGA DECOUPLING CAPACITORS
- (near R41) CLR Config
- (near R43) RST
- INIT Done
- SPI Flash -> 100 (M0, M1, M2)
- JTAG -> 101 (M0, M1, M2)
- M0 - M2 default to HIGH, toggle switch to pull LOW
- See UG470 for more info
- PROG Done
- FPGA ADC IN
- (near R49) DNF
- (near R50) DNF
- (in symbol CMP-007-000006-8) Title; Size; Project; Revision; Designer:; Sheet; of; Date:
- (in symbol CMP-0383-00020-1, part A) BANK 14
- (in symbol CMP-0383-00020-1, part B) BANK 15
- (in symbol CMP-0383-00020-1, part C) BANK 16
- (in symbol CMP-0383-00020-1, part D) BANK 34
- (in symbol CMP-0383-00020-1, part E) BANK 35

### Library data of the parts
*#4 = CMP-007-000006-8: Generic Title Block
C39-C46 C101 C102 C105 = CMP-001-00095-1: Cap Ceramic 0.1uF 50V X7R 20% SMD 0402 125°C Paper T/R GRM155R71H104ME14J; Voltage: 50V; Capacitance: 100nF; Case: 0402
C47 C65 = CMP-2008-04543-1: GRM155R60J225ME15D; Manufacturer: Murata; Part Number: GRM155R60J225ME15D
C48-C53 C58-C64 C106-C112 C121-C127 = CMP-001-00098-2: 0402 0.1 uF 25 V ±10% Tolerance X7R SMT Multilayer Ceramic Capacitor; Voltage Rating: 25V; Tolerance: 10%; Dielectric: X7R; Case/Package: 0402
C54-C57 C67 C75 C78 C87 C90 C99 C113 C128 = CMP-001-00097-1: Cap 10UF 6.3VDC X5R 20% SMD 0603 Paper Tape; Voltage Rating: 6.3V; Case/Package: 0603; Tolerance: 20%
C66 C76 C77 C88 C89 C100 C114 C115 C129 C130 = CMP-001-00100-1: Cap Ceramic 220uF 6.3V X5R 20% SMD 1210 85°C Emboss T/R GRM32ER60J227ME05K
C68-C74 C79-C86 C91-C98 C103 C104 C116-C120 C131-C133 = CMP-001-00099-1: Dielectric: X5R; Tolerance: 20%; Voltage Rating: 10V; Case/Package: 0402
C135 = CMP-2008-02634-1: 04025A300JAT2A; Manufacturer: AVX Interconnect / Elco; Part Number: 04025A300JAT2A
DS1 DS2 = CMP-007-00037-1: LED GREEN DIFFUSED SMD; Color: Green; Case/Package: 0603
J2 = CMP-2000-05415-1: SMA Connector, Pitch 5.08 mm, 1 Position, Height 9.5 mm, Tail Length 4 mm, -65 to 165 degC, RoHS, Bulk; Manufacturer: TE Connectivity; Connector Mounting: PCBMount; Connector Body Style: StraightJack; Impedance: 50ohm; Coaxial Termination: Solder; SVHC: NoSVHC(15-Jun-2015); Frequency Max: 3GHz; Product Range: ZDCSeries; Connector Type: SMACoaxial; Datasheet Version: Rev. B1, 03/2011; Package Reference: 5-1814832-1; Package Description: SMA Connector, Pitch 5.08 mm, 1 Position, Height 9.5 mm, Tail Length 4 mm; Contact Plating: GoldPlatedContacts; Coaxial Cable Types: -; Contact Material: BerylliumCopper; Manufacturer URL: http://www.te.com/; Datasheet URL: http://www.onlinecomponents.com/productFiles/mf-AMP/eng_cd_1814832_a.pdf
L5 = CMP-0220-00109-1: SMD EMI Suppression Ferrite Bead WE-CBF, Z = 600 Ohm; Impedance: 600 Ohm; ComponentLink2Description: Datasheet; ComponentLink1Description: Manufacturer Link; PackageReference: SMD-0402; PackageVersion: 2009; ComponentLink1URL: http://www.we-online.com; PackageDescription: Chip Inductor, 2-Leads, Body 1.0 x 0.5 mm; DatasheetVersion: ver 6, Jul-2009; ComponentLink2URL: http://www.we-online.de/katalog/media/pdf/74279279.pdf
Q1 = CMP-2000-05778-1: P-Channel MOSFET, 30 V, 4 A, -55 to 150 degC, 3-Pin SOT-23-3L, RoHS, Tape and Reel; Manufacturer: Alpha and Omega; Output Power (Max): NotRequiredW; Power Dissipation: 1.4W; Rad Hardened: No; Drain Efficiency: NotRequired%; Drain-Source On-Volt: 30V; Noise Figure: NotRequireddB; Frequency (Max): NotRequiredMHz; Number of  Elements: 1; Gate-Source Voltage (Max): ?12V; Drain Current (Max): 4A; Channel Mode: Enhancement; Drain-Source On-Res: 0.044ohm; Type: PowerMOSFET; Polarity: P; Package URL: http://www.aosmd.com/res/packaging_information/SOT-23-3L.pdf; Datasheet URL: http://www.aosmd.com/res/data_sheets/AO3401A.pdf; Package Type: SOT-23; Package Description: 3-Pin Small Outline Transistor, Body 2.95 x 1.6 mm, Pitch 0.95 mm; Mounting: SurfaceMount; Manufacturer URL: http://www.aosmd.com/; Continuous Drain Current: 4A; Package Reference: SOT-23-3L; Mounting Technology: SurfaceMount; Operating Temperature Classification: Military; Power Gain: NotRequireddB; Datasheet Version: Rev. 3, 03/2011; Operating Temp Range: -55Cto150C; Pin Count: 3
Q2 = CMP-2000-04929-2: MOSFET N-CH 60V 115MA SOT23-3; Turn-On Delay Time: 7ns; Turn-Off Delay Time: 11ns; Drain to Source Resistance: 7.5R; Rise Time: 3ns; Drain to Source Breakdown Voltage: 70V; Input Capacitance: 50pF; Number of Elements: 1; Power Dissipation: 540mW; Max Power Dissipation: 300mW; Fall Time: 5.6ns; Gate to Source Voltage (Vgs): 20V; Threshold Voltage: 2.5V; Element Configuration: Single; Termination: SMD/SMT; Weight: 0.000282oz; Radiation Hardening: No; Max Operating Temperature: 150°C; On-State Resistance: 7.5R; Mount: Surface Mount; Current Rating: 115mA; Contact Plating: Tin; Lead Free: Lead Free; Min Operating Temperature: -55°C; Number of Pins: 3; REACH SVHC: No SVHC; Drain to Source Voltage (Vdss): 60V; Width: 1.3mm; Package Quantity: 3000; Length: 2.9mm; Case/Package: SOT-23; Number of Channels: 1; Dual Supply Voltage: 60V; Packaging: Tape and Reel; Height: 1mm; Voltage Rating (DC): 60V; Nominal Vgs: 2.5V; Continuous Drain Current (ID): 115mA; Voltage: 60V; Rds On Max: 7.5R
R32 = CMP-2002-00605-3: Chip Resistor, 100 Ohm, +/- 1%, 100 mW, -55 to 155 degC, 0402 (1005 Metric), RoHS, Tape and Reel ERJ-2RKF1000X; Manufacturer: Basic Passives; Power Rating: 100 mW; Resistance: 100 Ohm; Voltage Rating: 50 V; Case\/Package: 0402; Width: 0.5 mm; Pins: 2; ComponentLink2Description: Datasheet; PackageReference: 0402; Height: 0.35 mm; Tolerance: 1%; DatasheetVersion: 04/2015; Case Code (Imperial): 0402; Min Operating Temperature: -55 degC; Radiation Hardening: No; Length: 1 mm; Package Quantity: 10000; PackageDescription: 2-Pin Surface Mount Device, Body 1 x 0.5 mm; Mounting Technology: Surface Mount; Case Code (Metric): 1005; Packaging: Tape and Reel; ComponentLink1URL: http://www.panasonic.com/; RoHSCompliant: true; Max Operating Temperature: 155 degC; REACH SVHC: Yes; PartNumber: ERJ-2RKF1000X; ComponentLink1Description: Manufacturer URL; ComponentLink2URL: http://industrial.panasonic.com/cdbs/www-data/pdf/RDA0000/AOA0000C86.pdf; Mount: Surface Mount
R34-R39 R41 R43-R45 = CMP-2002-03045-1: CRCW04021K00FKEDHP; Manufacturer: Vishay Dale; Part Number: CRCW04021K00FKEDHP
R40 R42 = CMP-2002-03055-1: CRCW04023K30FKEDHP; Manufacturer: Vishay Dale; Part Number: CRCW04023K30FKEDHP
R46 = CMP-2002-08459-1: CRCW04022K40FKED; Manufacturer: Vishay Dale; Part Number: CRCW04022K40FKED
R48-R51 = CMP-2002-03041-1: CRCW04020000Z0EDHP; Manufacturer: Vishay Dale; Part Number: CRCW04020000Z0EDHP
SW3 SW4 = CMP-08834-000008-1: SWITCH TACTILE SPST-NO 0.05A 24V; Throw Configuration: SPST; Switch Function: Off-Mom; Switch Travel: 0.25mm; Contact Current Rating: 50mA; Actuator Length: 0.8mm; Mechanical Life: 500000Cycles; Contact Resistance: 100mR; Operating Force: 1.57N; Actuator Type: Standard; Illumination Type: Non-Illuminated; Ratings: IP67; Number of Poles: 1; Package Quantity: 1; Orientation: Straight; REACH SVHC: No SVHC; Lead Free: Lead Free; Max Current Rating: 50mA; Contact Plating: Silver; Current Rating: 50mA; Depth: 9mm; Contact Material: Bronze; Electrical Life: 500000Cycles; Termination: Gull Wing; Width: 6mm; Packaging: Tape and Reel; Min Operating Temperature: -25°C; Radiation Hardening: No; Max Voltage Rating (DC): 24V; Max Operating Temperature: 70°C; Length: 6.6mm; Height: 3.65mm; Voltage Rating (DC): 24V; Weight: 0.010582oz; Mount: Surface Mount
SW5 = CMP-08827-000069-1: SWITCH SLIDE DIP SPST 25MA 24V; Number of Positions: 3; Actuator Length: 0mm; Actuator Type: Slide (Standard); Electrical Life: 1000Cycles; Pitch: 0.1inch; Washable: No; Contact Resistance: 200mR; Max Operating Temperature: 70°C; Min Operating Temperature: -20°C; RoHS Compliant: Yes; Case/Package: DIP; Voltage Rating (DC): 24V; Number of Circuits: 3; Orientation: Straight; Contact Material: Gold; Series: A6S-H; Terminal Pitch: 2.54mm; Contact Current Rating: 25mA; Mount: Surface Mount; Packaging: Rail/Tube; Contact Plating: Gold; Max Current Rating: 25mA; Package Quantity: 55; Length: 0.337inch; Current Rating: 25mA; REACH SVHC: No SVHC; Max Voltage Rating (DC): 24V; Mechanical Life: 1000Cycles; Throw Configuration: SPST; Termination: Gull Wing
TP16-TP115 = CMP-00028-00007-1: SMD Test point 0.5mm Diameter
U9 = CMP-0383-00020-1: Artix-7 FPGA, 250 User I/Os, 4 GTP, 484-Ball BGA, Speed Grade 1, Commercial Grade, Pb-Free; Manufacturer: Xilinx; GTP: 4; Total Block RAM: 1800 Kb; CMTs: 5; Logic Cells: 33280; Available User I/O: 250; Speed Grades: 1; Mounting Technology: Surface Mount; ComponentLink4URL: http://www.xilinx.com/support/documentation/user_guides/ug475_7Series_Pkg_Pinout.pdf; PackageVersion: Rev. 1.11; ComponentLink3URL: http://www.xilinx.com/support/documentation/user_guides/ug475_7Series_Pkg_Pinout.pdf; PartNumber: XC7A35T-1FGG484C; ComponentLink1Description: Manufacturer URL; ComponentLink2URL: http://www.xilinx.com/support/documentation/data_sheets/ds180_7Series_Overview.pdf; DatasheetVersion: Rev. 1.15; ComponentLink1URL: http://www.xilinx.com/; ComponentLink4Description: Package Specification; ComponentLink2Description: Datasheet; Maximum Distributed RAM: 400 Kb; PackageReference: FGG484; PackageDescription: 484-Ball Wire-Bond Fine-Pitch BGA, Body 23 x 23 mm, Pitch 1 mm; Operating Temperature Range: Commercial; ComponentLink3Description: Pinout
U10 = CMP-0192-00223-1: Precision Temperature-to-Voltage Converter, 3-Pin SOT-23, Extended Temperature, Tape and Reel; PackageVersion: revBB, Aug-2009; Code_IPC: SOT23-3; PackageDescription: 3-Lead Plastic Small Outline Transistor (NB) [SOT-23]; DatasheetVersion: revC, May-2005; PackageReference: SOT-23-NB3
U11 = CMP-023-00001-1: Xtal Osc Xo 135.0000MHZ Lvds SMD; Frequency: 135Mhz; Output: LVDS
U12 = CMP-0367-00158-2: 1.25 V, 50 ppm / degC, 50 uA Series (Bandgap) Voltage Reference, -40 to 125 degC, 3-pin SOT-23 (DBZ), Green (RoHS & no Sb/Br); Manufacturer: Texas Instruments; Iq(Max)(uA): 50; Initial Accuracy @ 25/deg C(%): 0.2; Rating: Catalog; VI(Max)(V): 5.5; VI(Min)(V): 1.8; Temp Coeff(Typ)(ppm/ degree C): 20; SubFamily: Series Voltage Reference; VO(V): 1.25; ComponentLink1Description: Manufacturer URL; ComponentLink1URL: http://www.ti.com/; PartNumber: REF3012AIDBZT; PackageDescription: 3-Pin Plastic Small Outline, Body 2.92 x 1.3 mm, Pitch 0.95 mm; Mounting Technology: Surface Mount; Eco-Plan: Green (RoHS & no Sb/Br); PackageVersion: 4203227/B; ComponentLink2URL: http://www.ti.com/general/docs/lit/getliterature.tsp?genericPartNumber=REF3012&fileType=pdf; ComponentLink2Description: Datasheet; Temp Coeff(Max)(ppm/ degree C): 50; Code_JEDEC: TO-236; PackageReference: DBZ0003A; ComponentLink3Description: Package Specification; DatasheetVersion: SBVS032F; ComponentLink3URL: http://www.ti.com/litv/pdf/mpds108a
U13 = CMP-019-00065-2: Flash, Multi I/O SPI, QPI, DTR, 2.3-3.6V, -40 to 125°C, 8-pin SOIC 208mil, RoHS; Frequency: 133MHz; Memory Format: Non-Volatile,FLASH; Memory Size: 128Mb; Case/Package: SOIC
X1 = CMP-003-00032-1: Single Ended CMOS Oscillator 3.3V 100Mhz